# EAGLE schematic BSC_mini (EAGLE 7.7.0), part 1 of 2
DRAWING_NUMBER: V002; DRAWN: Mario Blunk; PROJECT: SYSTEM M-1; STATUS: PRODUCT

## Sheet 1 of 25
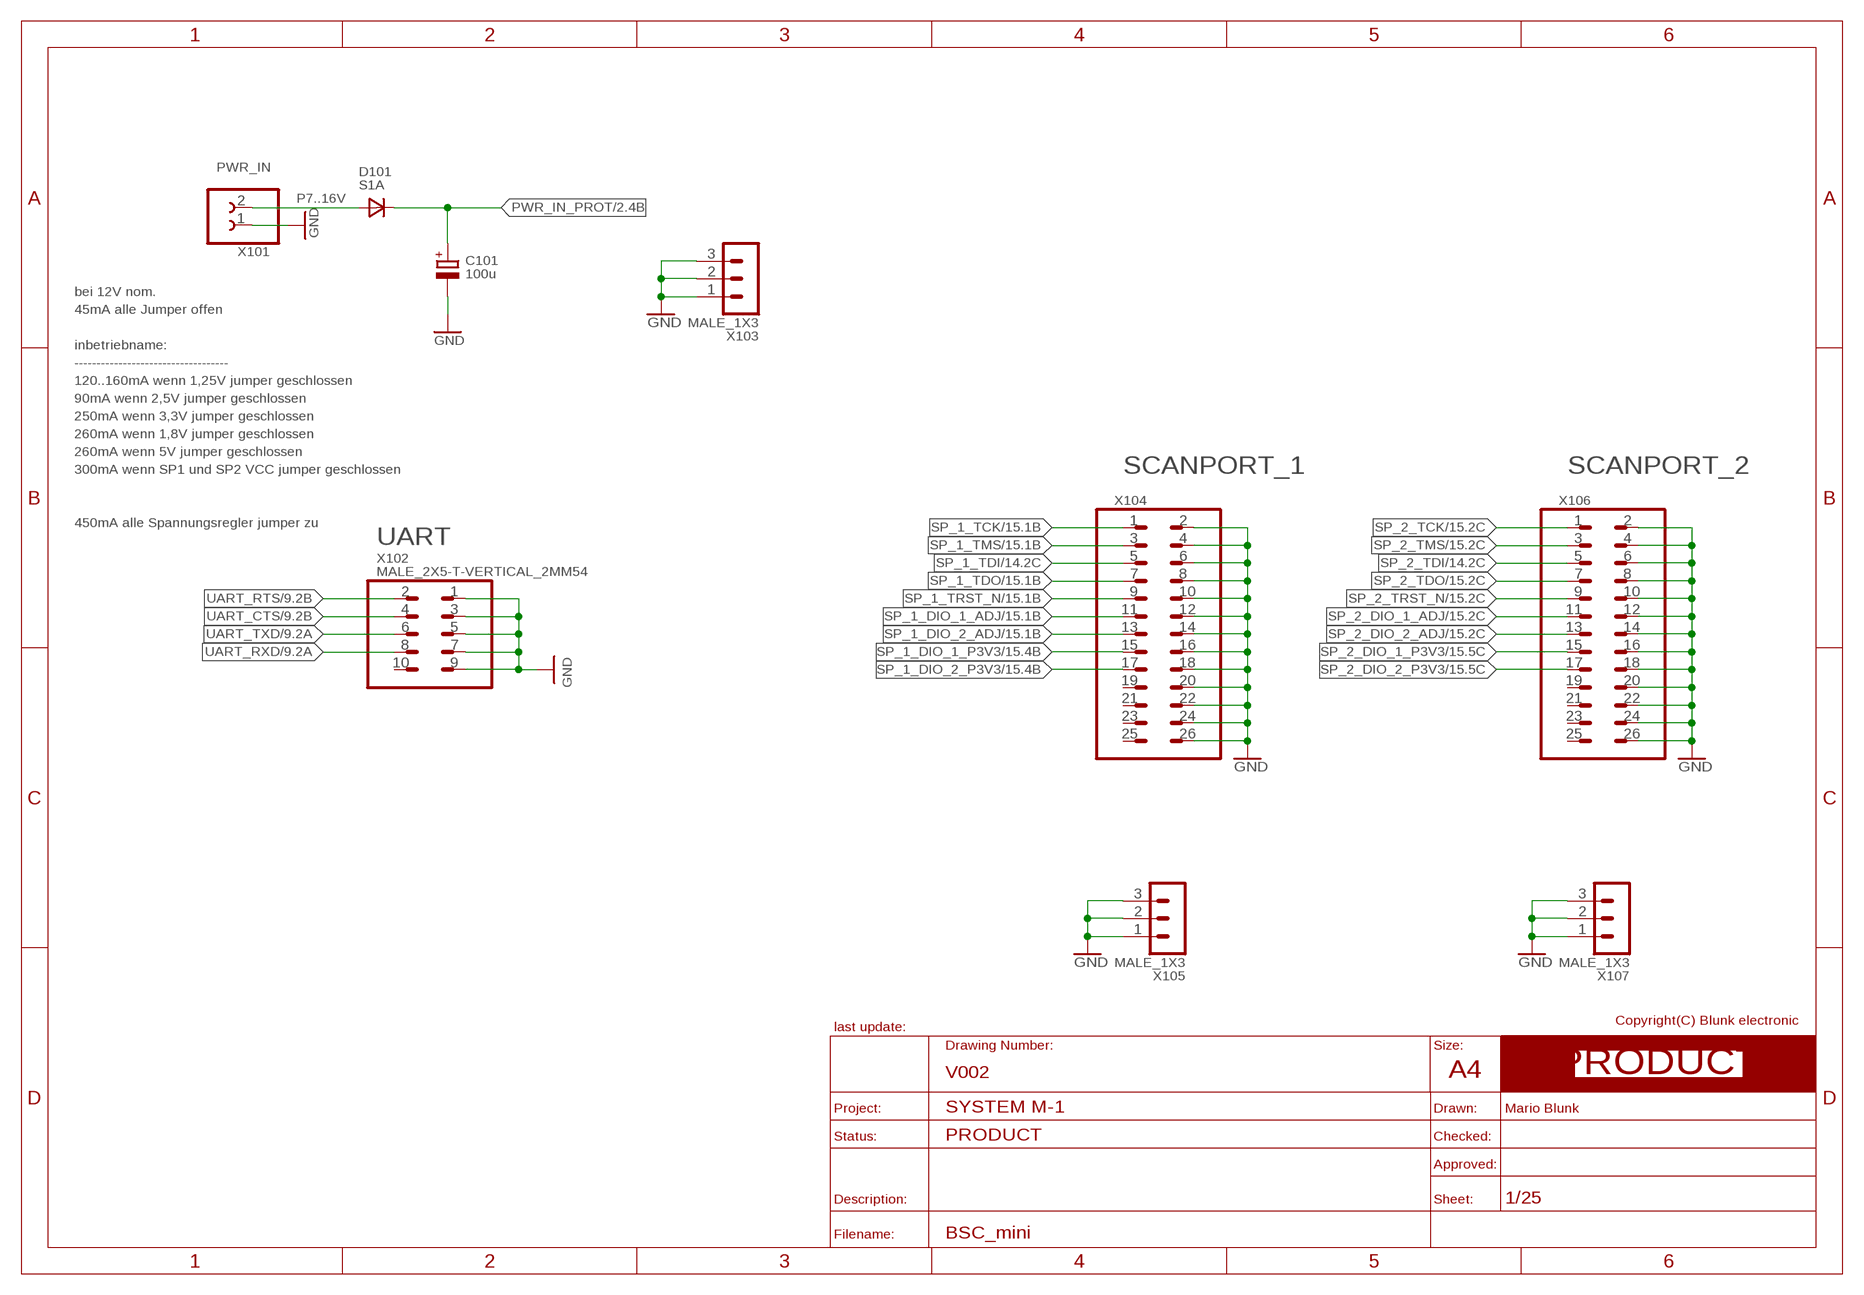
[diagram p0: schematic, sheet 1]
FRAME_PRODUCT2 (A4_LANDSCAPE_PRODUCT): BOM: NO; COMMISSIONED: 2013-08-30; DESCRIPTION: POWER-IN AND SCANPORT CNTRS

### Parts
C101  100u  C_POL_S_RAD_10MM  [S_RADIAL_10MM]
D101  S1A  SINGLE_S_DO214AC  [S_DO214AC]
X101  CLAMP_1X2-T-2.5MM  [T_WIRE_CLAMP_1X2_PITCH_2MM5]
X102  MALE_2X5-T-VERTICAL_2MM54  [T_MALE_2X5_VERTICAL_PITCH_2MM54]
X103  MALE_1X3  [T_MALE_3X1_VERTICAL]
X104  MALE_2X13-T-VERTICAL_PITCH_2MM54  [T_MALE_2X13_VERTICAL_PITCH_2MM54]
X105  MALE_1X3  [T_MALE_3X1_VERTICAL]
X106  MALE_2X13-T-VERTICAL_PITCH_2MM54  [T_MALE_2X13_VERTICAL_PITCH_2MM54]
X107  MALE_1X3  [T_MALE_3X1_VERTICAL]

### Nets
GND: C101.- X101.1 X102.1 X102.3 X102.5 X102.7 X102.9 X103.1 X103.2 X103.3 X104.2 X104.4 X104.6 X104.8 X104.10 X104.12 X104.14 X104.16 X104.18 X104.20 X104.22 X104.24 X104.26 X105.1 X105.2 X105.3 X106.2 X106.4 X106.6 X106.8 X106.10 X106.12 X106.14 X106.16 X106.18 X106.20 X106.22 X106.24 X106.26 X107.1 X107.2 X107.3 ; also sheet 2,3,4,5,6,7,8,11,12,13,14,16,17,18,19,20,21,22,23,24,25
PWR_IN: D101.A X101.2
PWR_IN_PROT: C101.+ D101.C ; also sheet 2,3
SP_1_DIO_1_ADJ: X104.11 ; also sheet 15,23
SP_1_DIO_1_P3V3: X104.15 ; also sheet 15,23
SP_1_DIO_2_ADJ: X104.13 ; also sheet 15,23
SP_1_DIO_2_P3V3: X104.17 ; also sheet 15,23
SP_1_TCK: X104.1 ; also sheet 15,21
SP_1_TDI: X104.5 ; also sheet 14
SP_1_TDO: X104.7 ; also sheet 15,21
SP_1_TMS: X104.3 ; also sheet 15,21
SP_1_TRST_N: X104.9 ; also sheet 15,22
SP_2_DIO_1_ADJ: X106.11 ; also sheet 15,23
SP_2_DIO_1_P3V3: X106.15 ; also sheet 15,23
SP_2_DIO_2_ADJ: X106.13 ; also sheet 15,23
SP_2_DIO_2_P3V3: X106.17 ; also sheet 15,23
SP_2_TCK: X106.1 ; also sheet 15,21
SP_2_TDI: X106.5 ; also sheet 14
SP_2_TDO: X106.7 ; also sheet 15,21
SP_2_TMS: X106.3 ; also sheet 15,21
SP_2_TRST_N: X106.9 ; also sheet 15,22
UART_CTS: X102.4 ; also sheet 9
UART_RTS: X102.2 ; also sheet 9
UART_RXD: X102.8 ; also sheet 9
UART_TXD: X102.6 ; also sheet 9
Unconnected: X102.10 X104.19 X104.21 X104.23 X104.25 X106.19 X106.21 X106.23 X106.25

### Notes on the sheet
- P7..16V
- bei 12V nom.
- 45mA alle Jumper offen
- inbetriebname:
- -----------------------------------
- 120..160mA wenn 1,25V jumper geschlossen
- 90mA wenn 2,5V jumper geschlossen
- 250mA wenn 3,3V jumper geschlossen
- 260mA wenn 1,8V jumper geschlossen
- 260mA wenn 5V jumper geschlossen
- 300mA wenn SP1 und SP2 VCC jumper geschlossen
- 450mA alle Spannungsregler jumper zu

## Sheet 2 of 25
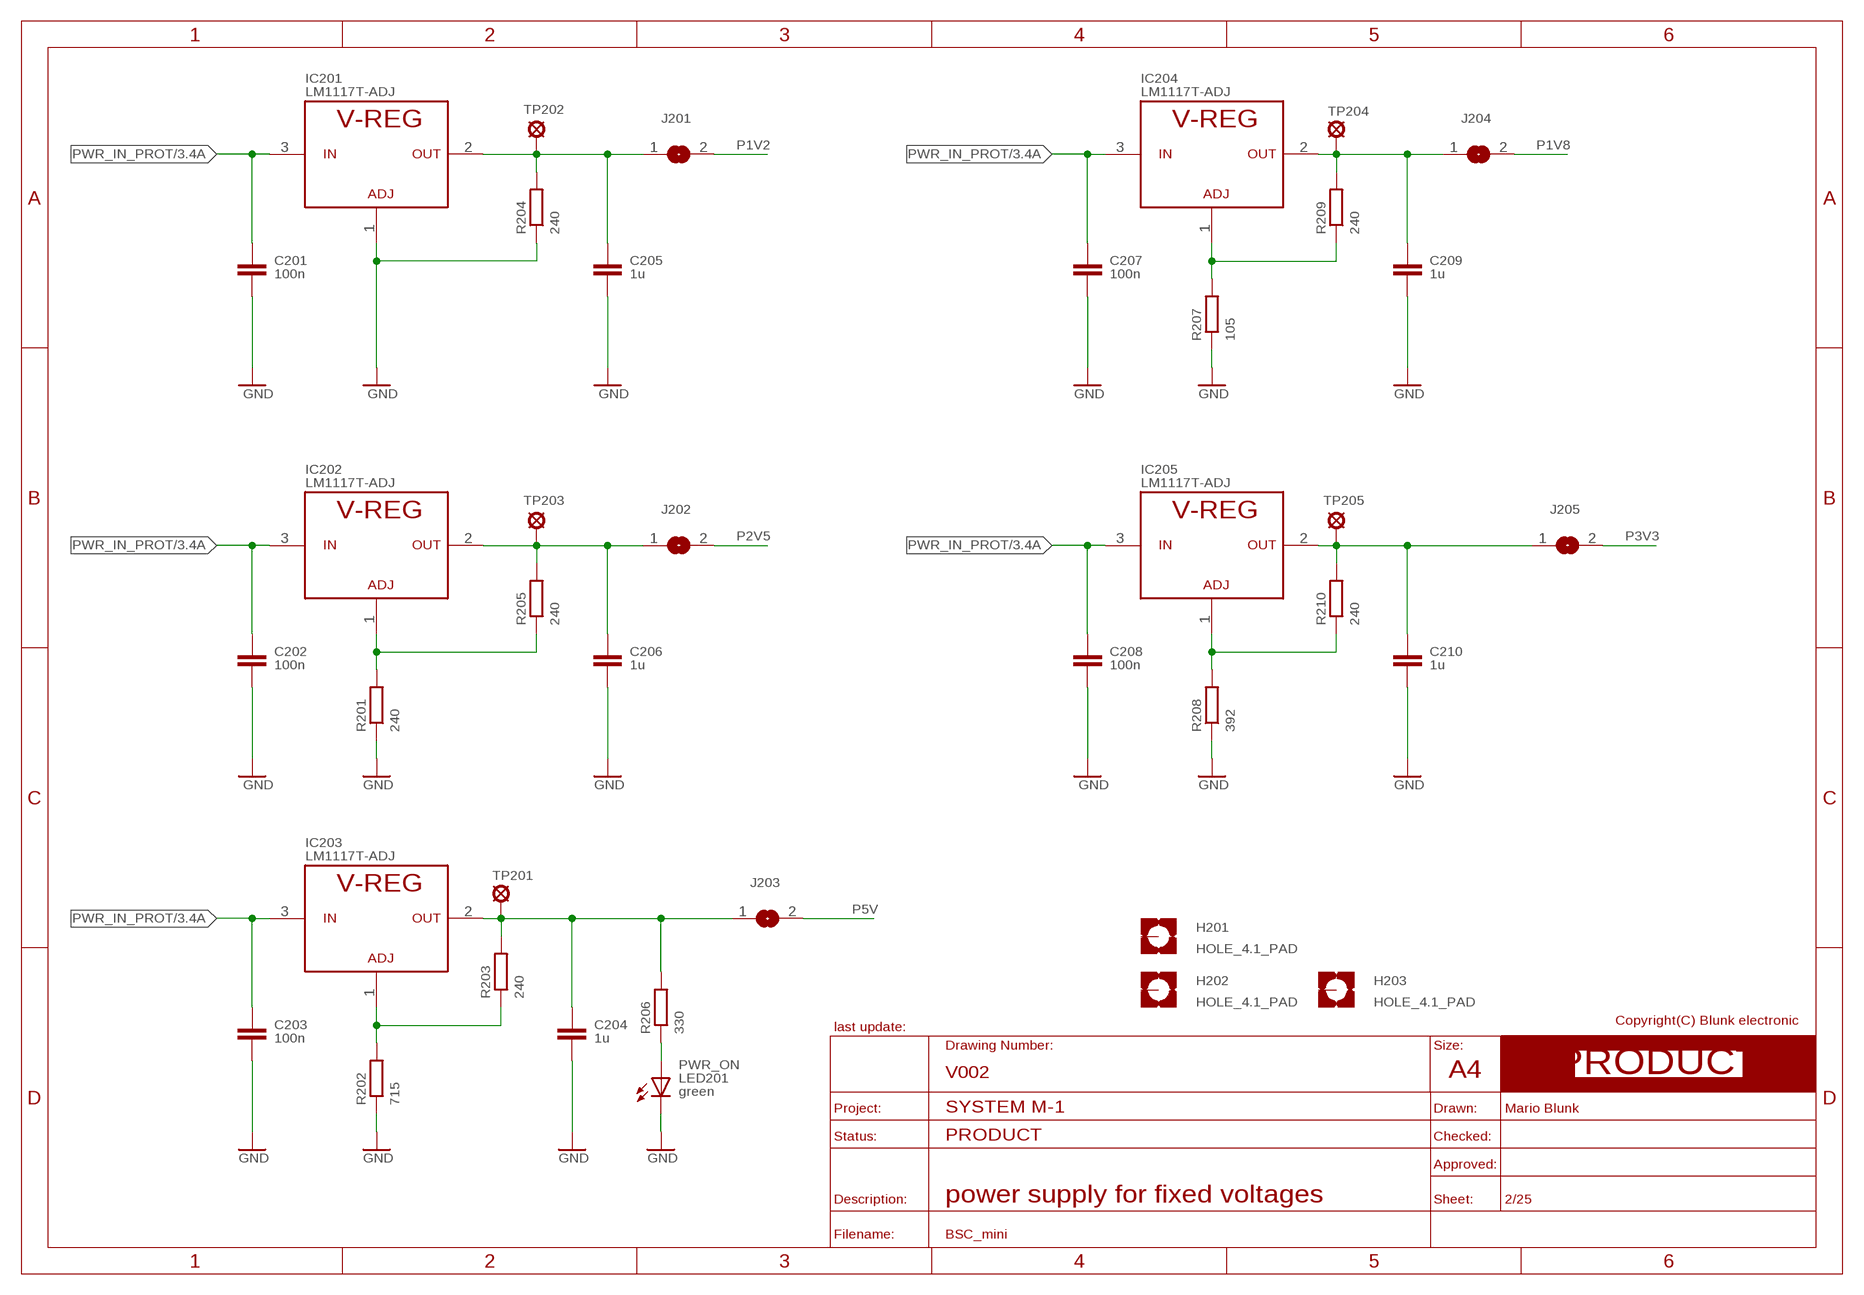
[diagram p1: schematic, sheet 2]
FRAME_PRODUCT5 (A4_LANDSCAPE_PRODUCT): BOM: NO; COMMISSIONED: 2013-08-30; DESCRIPTION: power supply for fixed voltages

### Parts
C201  100n  C_S_0805  [S_0805]
C202  100n  C_S_0805  [S_0805]
C203  100n  C_S_0805  [S_0805]
C204  1u  C_S_0805  [S_0805]
C205  1u  C_S_0805  [S_0805]
C206  1u  C_S_0805  [S_0805]
C207  100n  C_S_0805  [S_0805]
C208  100n  C_S_0805  [S_0805]
C209  1u  C_S_0805  [S_0805]
C210  1u  C_S_0805  [S_0805]
H201  HOLE_4.1_PAD  [4.1_PAD]
H202  HOLE_4.1_PAD  [4.1_PAD]
H203  HOLE_4.1_PAD  [4.1_PAD]
IC201  LM1117T-ADJ  LMXX17-T_VERTICAL  [T_TO220-3_VERTICAL]
IC202  LM1117T-ADJ  LMXX17-T_VERTICAL  [T_TO220-3_VERTICAL]
IC203  LM1117T-ADJ  LMXX17-T_VERTICAL  [T_TO220-3_VERTICAL]
IC204  LM1117T-ADJ  LMXX17-T_VERTICAL  [T_TO220-3_VERTICAL]
IC205  LM1117T-ADJ  LMXX17-T_HORIZONTAL  [T_TO220-3_HORIZONTAL]
J201  SOLDER_JUMPER-N  [S_SOLDER_JUMPER_NARROW]
J202  SOLDER_JUMPER-N  [S_SOLDER_JUMPER_NARROW]
J203  SOLDER_JUMPER-N  [S_SOLDER_JUMPER_NARROW]
J204  SOLDER_JUMPER-N  [S_SOLDER_JUMPER_NARROW]
J205  SOLDER_JUMPER-N  [S_SOLDER_JUMPER_NARROW]
LED201  green  LED_S_0805  [S_0805]
R201  240  R_S_0805  [S_0805]
R202  715  R_S_0805  [S_0805]
R203  240  R_S_0805  [S_0805]
R204  240  R_S_0805  [S_0805]
R205  240  R_S_0805  [S_0805]
R206  330  R_S_0805  [S_0805]
R207  105  R_S_0805  [S_0805]
R208  392  R_S_0805  [S_0805]
R209  240  R_S_0805  [S_0805]
R210  240  R_S_0805  [S_0805]
TP201  TEST_POINT_T_SMALL  [T_TEST_POINT_SMALL]
TP202  +1V2  TEST_POINT_T_SMALL  [T_TEST_POINT_SMALL]
TP203  +2V5  TEST_POINT_T_SMALL  [T_TEST_POINT_SMALL]
TP204  TEST_POINT_T_SMALL  [T_TEST_POINT_SMALL]
TP205  +2V5  TEST_POINT_T_SMALL  [T_TEST_POINT_SMALL]

### Nets
GND: C201.2 C202.2 C203.2 C204.2 C205.2 C206.2 C207.2 C208.2 C209.2 C210.2 IC201.1(AJD) LED201.C R201.1 R202.1 R204.1 R207.1 R208.1 ; also sheet 1,3,4,5,6,7,8,11,12,13,14,16,17,18,19,20,21,22,23,24,25
P1V2: J201.2 ; also sheet 11
P1V8: J204.2 ; also sheet 16
P2V5: J202.2 ; also sheet 5,8,10,11
P3V3: J205.2 ; also sheet 3,4,6,7,8,9,10,11,12,13,14,16,17,18,19,20,21,22,23,24,25
P5V: J203.2 ; also sheet 13
PWR_ADJ_P1V8: IC204.1(AJD) R207.2 R209.1
PWR_ADJ_P2V5: IC202.1(AJD) R201.2 R205.1
PWR_ADJ_P3V3: IC205.1(AJD) R208.2 R210.1
PWR_ADJ_P5V: IC203.1(AJD) R202.2 R203.1
PWR_IN_PROT: C201.1 C202.1 C203.1 C207.1 C208.1 IC201.3(IN) IC202.3(IN) IC203.3(IN) IC204.3(IN) IC205.3(IN) ; also sheet 1,3
PWR_LED_P5V: LED201.A R206.1
PWR_P1V2: C205.1 IC201.2(OUT) J201.1 R204.2 TP202.1(TP)
PWR_P1V8: C209.1 IC204.2(OUT) J204.1 R209.2 TP204.1(TP)
PWR_P2V5: C206.1 IC202.2(OUT) J202.1 R205.2 TP203.1(TP)
PWR_P3V3: C210.1 IC205.2(OUT) J205.1 R210.2 TP205.1(TP)
PWR_P5V: C204.1 IC203.2(OUT) J203.1 R203.2 R206.2 TP201.1(TP)
Unconnected: H201.H1(MOUNT) H202.H1(MOUNT) H203.H1(MOUNT)

## Sheet 3 of 25
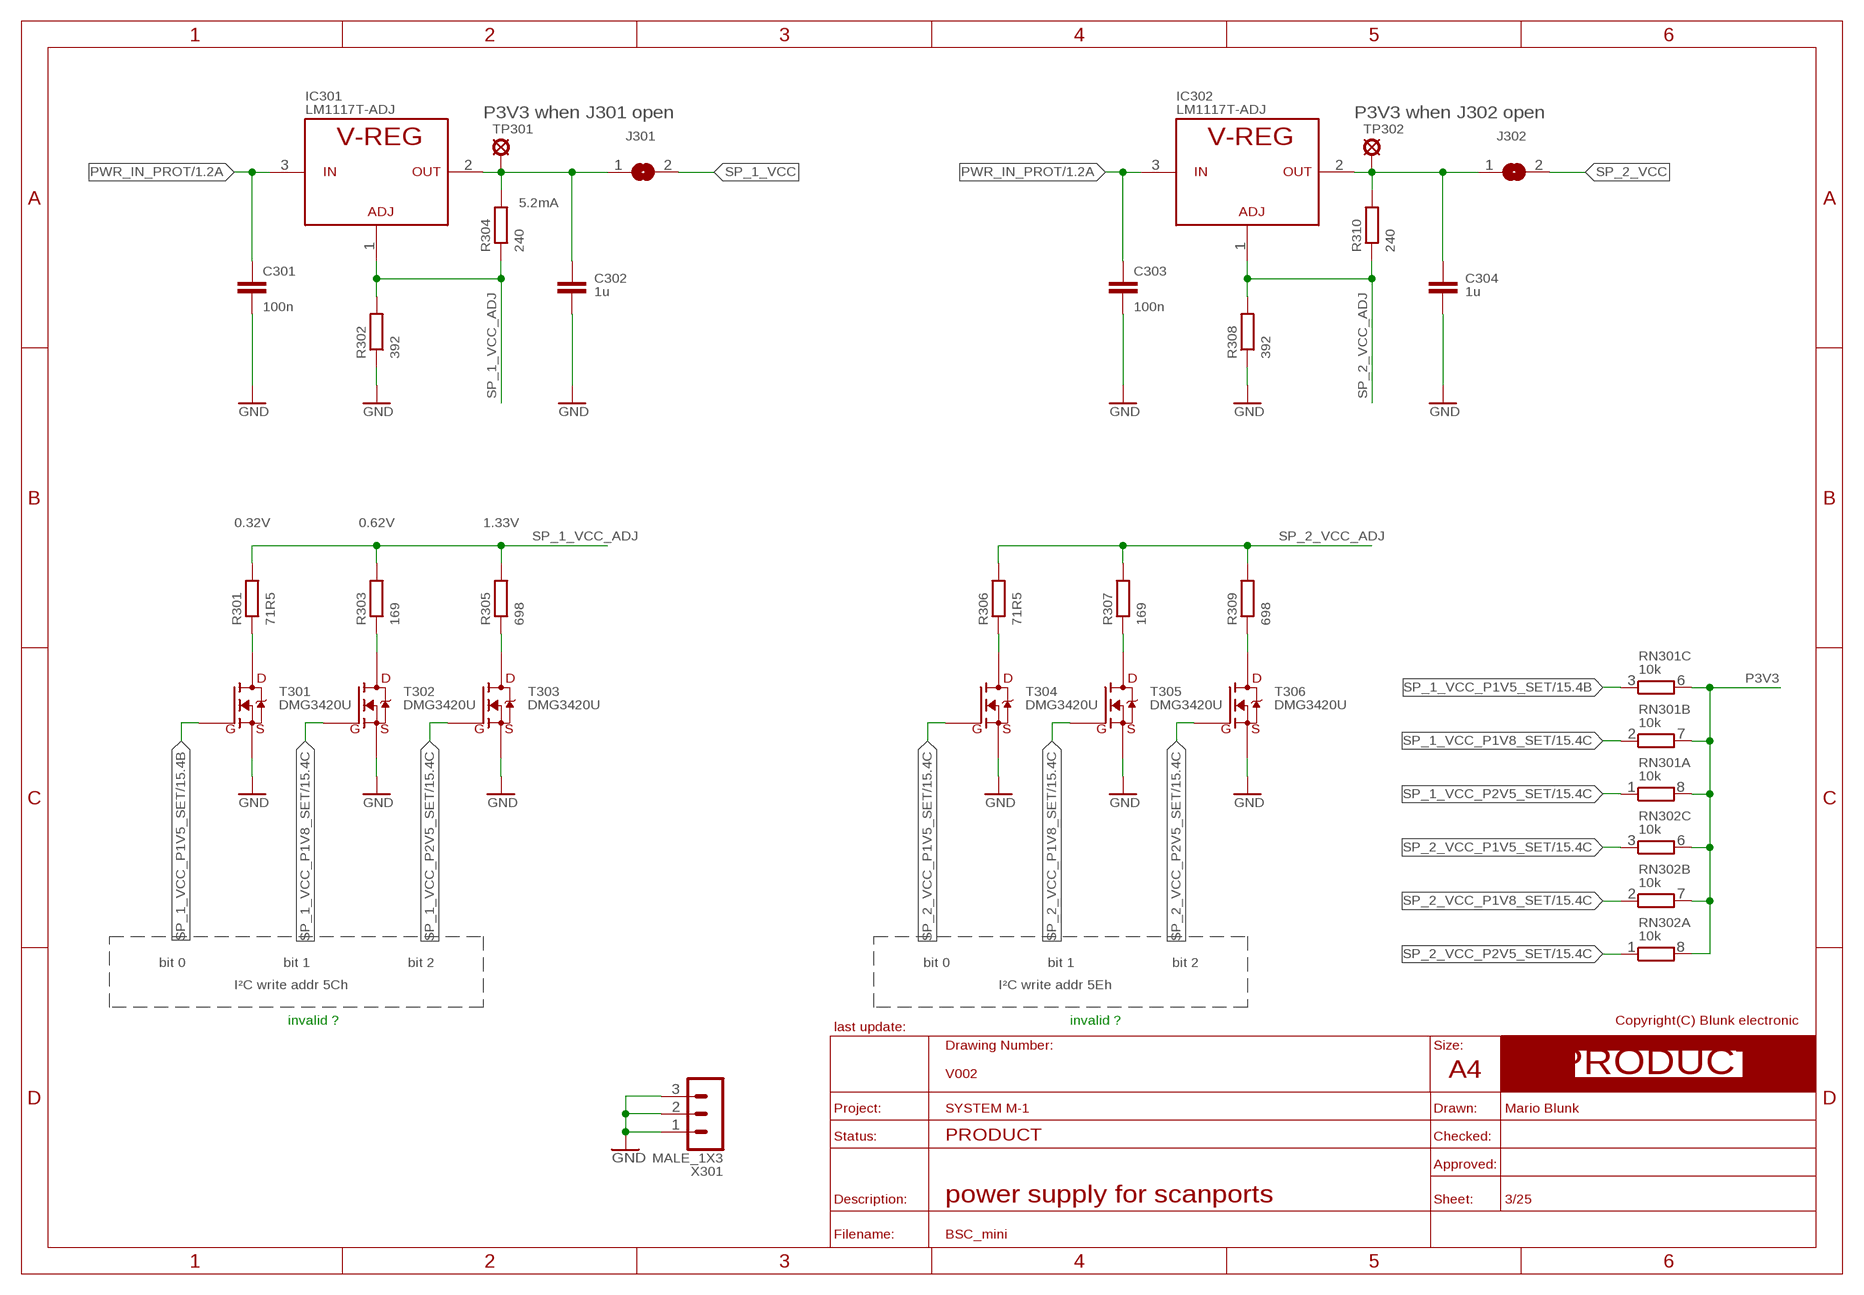
[diagram p2: schematic, sheet 3]
FRAME_PRODUCT23 (A4_LANDSCAPE_PRODUCT): BOM: NO; COMMISSIONED: 2013-08-30; DESCRIPTION: power supply for scanports

### Parts
C301  100n  C_S_0805  [S_0805]
C302  1u  C_S_0805  [S_0805]
C303  100n  C_S_0805  [S_0805]
C304  1u  C_S_0805  [S_0805]
IC301  LM1117T-ADJ  LMXX17-T_VERTICAL  [T_TO220-3_VERTICAL]
IC302  LM1117T-ADJ  LMXX17-T_VERTICAL  [T_TO220-3_VERTICAL]
J301  SOLDER_JUMPER-N  [S_SOLDER_JUMPER_NARROW]
J302  SOLDER_JUMPER-N  [S_SOLDER_JUMPER_NARROW]
R301  71R5  R_S_0805  [S_0805]
R302  392  R_S_0805  [S_0805]
R303  169  R_S_0805  [S_0805]
R304  240  R_S_0805  [S_0805]
R305  698  R_S_0805  [S_0805]
R306  71R5  R_S_0805  [S_0805]
R307  169  R_S_0805  [S_0805]
R308  392  R_S_0805  [S_0805]
R309  698  R_S_0805  [S_0805]
R310  240  R_S_0805  [S_0805]
RN301  10k  RN_4S_1206  [S_1206_4X]
RN302  10k  RN_4S_1206  [S_1206_4X]
T301  DMG3420U  N-MOSFET_S_SOT23  [S_SOT23]
T302  DMG3420U  N-MOSFET_S_SOT23  [S_SOT23]
T303  DMG3420U  N-MOSFET_S_SOT23  [S_SOT23]
T304  DMG3420U  N-MOSFET_S_SOT23  [S_SOT23]
T305  DMG3420U  N-MOSFET_S_SOT23  [S_SOT23]
T306  DMG3420U  N-MOSFET_S_SOT23  [S_SOT23]
TP301  TEST_POINT_T_SMALL  [T_TEST_POINT_SMALL]
TP302  TEST_POINT_T_SMALL  [T_TEST_POINT_SMALL]
X301  MALE_1X3  [T_MALE_3X1_VERTICAL]

### Nets
GND: C301.2 C302.2 C303.2 C304.2 R302.1 R308.1 T301.2(S) T302.2(S) T303.2(S) T304.2(S) T305.2(S) T306.2(S) X301.1 X301.2 X301.3 ; also sheet 1,2,4,5,6,7,8,11,12,13,14,16,17,18,19,20,21,22,23,24,25
P3V3: RN301.6 RN301.7 RN301.8 RN302.6 RN302.7 RN302.8 ; also sheet 2,4,6,7,8,9,10,11,12,13,14,16,17,18,19,20,21,22,23,24,25
PWR_IN_PROT: C301.1 C303.1 IC301.3(IN) IC302.3(IN) ; also sheet 1,2
SP_1_VCC: J301.2 ; also sheet 16
SP_1_VCC_ADJ: IC301.1(AJD) R301.2 R302.2 R303.2 R304.1 R305.2
SP_1_VCC_P1V5_D: R301.1 T301.3(D)
SP_1_VCC_P1V5_SET: RN301.3 T301.1(G) ; also sheet 15,24
SP_1_VCC_P1V8_D: R303.1 T302.3(D)
SP_1_VCC_P1V8_SET: RN301.2 T302.1(G) ; also sheet 15,24
SP_1_VCC_P2V5_D: R305.1 T303.3(D)
SP_1_VCC_P2V5_SET: RN301.1 T303.1(G) ; also sheet 15,24
SP_1_VCC_REG: C302.1 IC301.2(OUT) J301.1 R304.2 TP301.1(TP)
SP_2_VCC: J302.2 ; also sheet 16
SP_2_VCC_ADJ: IC302.1(AJD) R306.2 R307.2 R308.2 R309.2 R310.1
SP_2_VCC_P1V5_D: R306.1 T304.3(D)
SP_2_VCC_P1V5_SET: RN302.3 T304.1(G) ; also sheet 15,25
SP_2_VCC_P1V8_D: R307.1 T305.3(D)
SP_2_VCC_P1V8_SET: RN302.2 T305.1(G) ; also sheet 15,25
SP_2_VCC_P2V5_D: R309.1 T306.3(D)
SP_2_VCC_P2V5_SET: RN302.1 T306.1(G) ; also sheet 15,25
SP_2_VCC_REG: C304.1 IC302.2(OUT) J302.1 R310.2 TP302.1(TP)
Unconnected: RN301.4 RN301.5 RN302.4 RN302.5

### Notes on the sheet
- P3V3 when J301 open | P3V3 when J302 open
- 5.2mA
- 0.32V | 0.62V | 1.33V
- bit 0 | bit 1 | bit 2 | bit 0 | bit 1 | bit 2
- I²C write addr 5Ch | I²C write addr 5Eh
- invalid ? | invalid ?

## Sheet 4 of 25
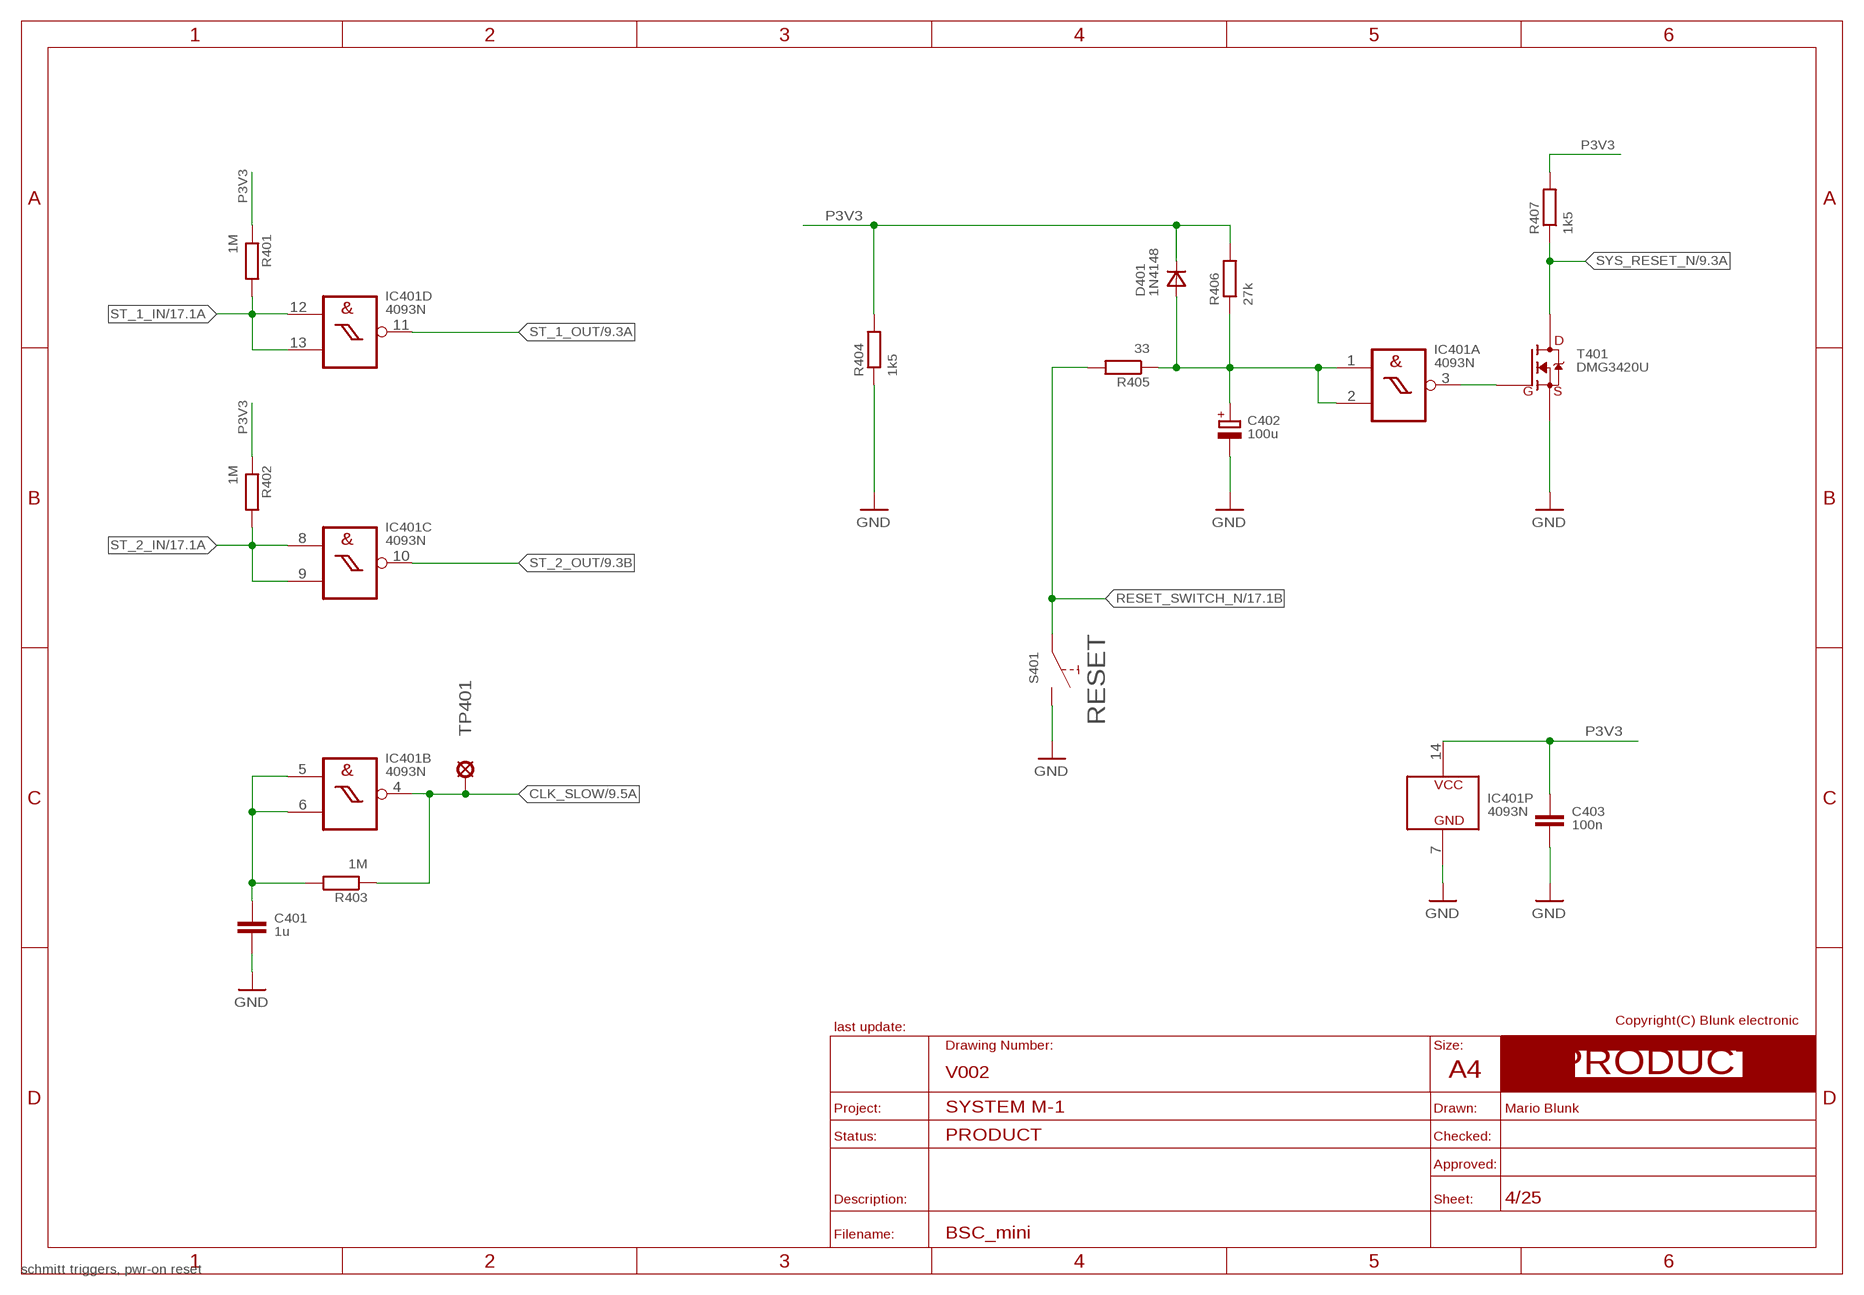
[diagram p3: schematic, sheet 4]
FRAME_PRODUCT4 (A4_LANDSCAPE_PRODUCT): BOM: NO; COMMISSIONED: 2013-08-30; DESCRIPTION: schmitt triggers, pwr-on reset

### Parts
C401  1u  C_S_0805  [S_0805]
C402  100u  C_POL_S_6032  [S_6032]
C403  100n  C_S_0805  [S_0805]
D401  1N4148  SINGLES_SOD123  [S_SOD123]
IC401  4093N  [T_NDIP14]
R401  1M  R_S_0805  [S_0805]
R402  1M  R_S_0805  [S_0805]
R403  1M  R_S_0805  [S_0805]
R404  1k5  R_S_0805  [S_0805]
R405  33  R_S_0805  [S_0805]
R406  27k  R_S_0805  [S_0805]
R407  1k5  R_S_0805  [S_0805]
S401  PUSH_BUTTON_T_6X6MM  [T_PUSH_BUTTON_6X6]
T401  DMG3420U  N-MOSFET_S_SOT23  [S_SOT23]
TP401  clk_slow  TEST_POINT_T_SMALL  [T_TEST_POINT_SMALL]

### Nets
CLK_SLOW: IC401.4(B:O) R403.1 TP401.1(TP) ; also sheet 9,17
GND: C401.2 C402.- C403.2 IC401.7(P:GND) R404.1 S401.2(B1) S401.4(B1) T401.2(S) ; also sheet 1,2,3,5,6,7,8,11,12,13,14,16,17,18,19,20,21,22,23,24,25
OSC_RC: C401.1 IC401.5(B:I0) IC401.6(B:I1) R403.2
P3V3: C403.1 D401.C IC401.14(P:VCC) R401.1 R402.1 R404.2 R406.2 R407.2 ; also sheet 2,3,6,7,8,9,10,11,12,13,14,16,17,18,19,20,21,22,23,24,25
RESET_RC_N: C402.+ D401.A IC401.1(A:I0) IC401.2(A:I1) R405.1 R406.1
RESET_SWITCH_N: R405.2 S401.1(A1) S401.3(A1) ; also sheet 17
ST_1_IN: IC401.12(D:I0) IC401.13(D:I1) R401.2 ; also sheet 17
ST_1_OUT: IC401.11(D:O) ; also sheet 9,17
ST_2_IN: IC401.8(C:I0) IC401.9(C:I1) R402.2 ; also sheet 17
ST_2_OUT: IC401.10(C:O) ; also sheet 9,17
SYS_RESET: IC401.3(A:O) T401.1(G)
SYS_RESET_N: R407.1 T401.3(D) ; also sheet 9,15,17

## Sheet 5 of 25
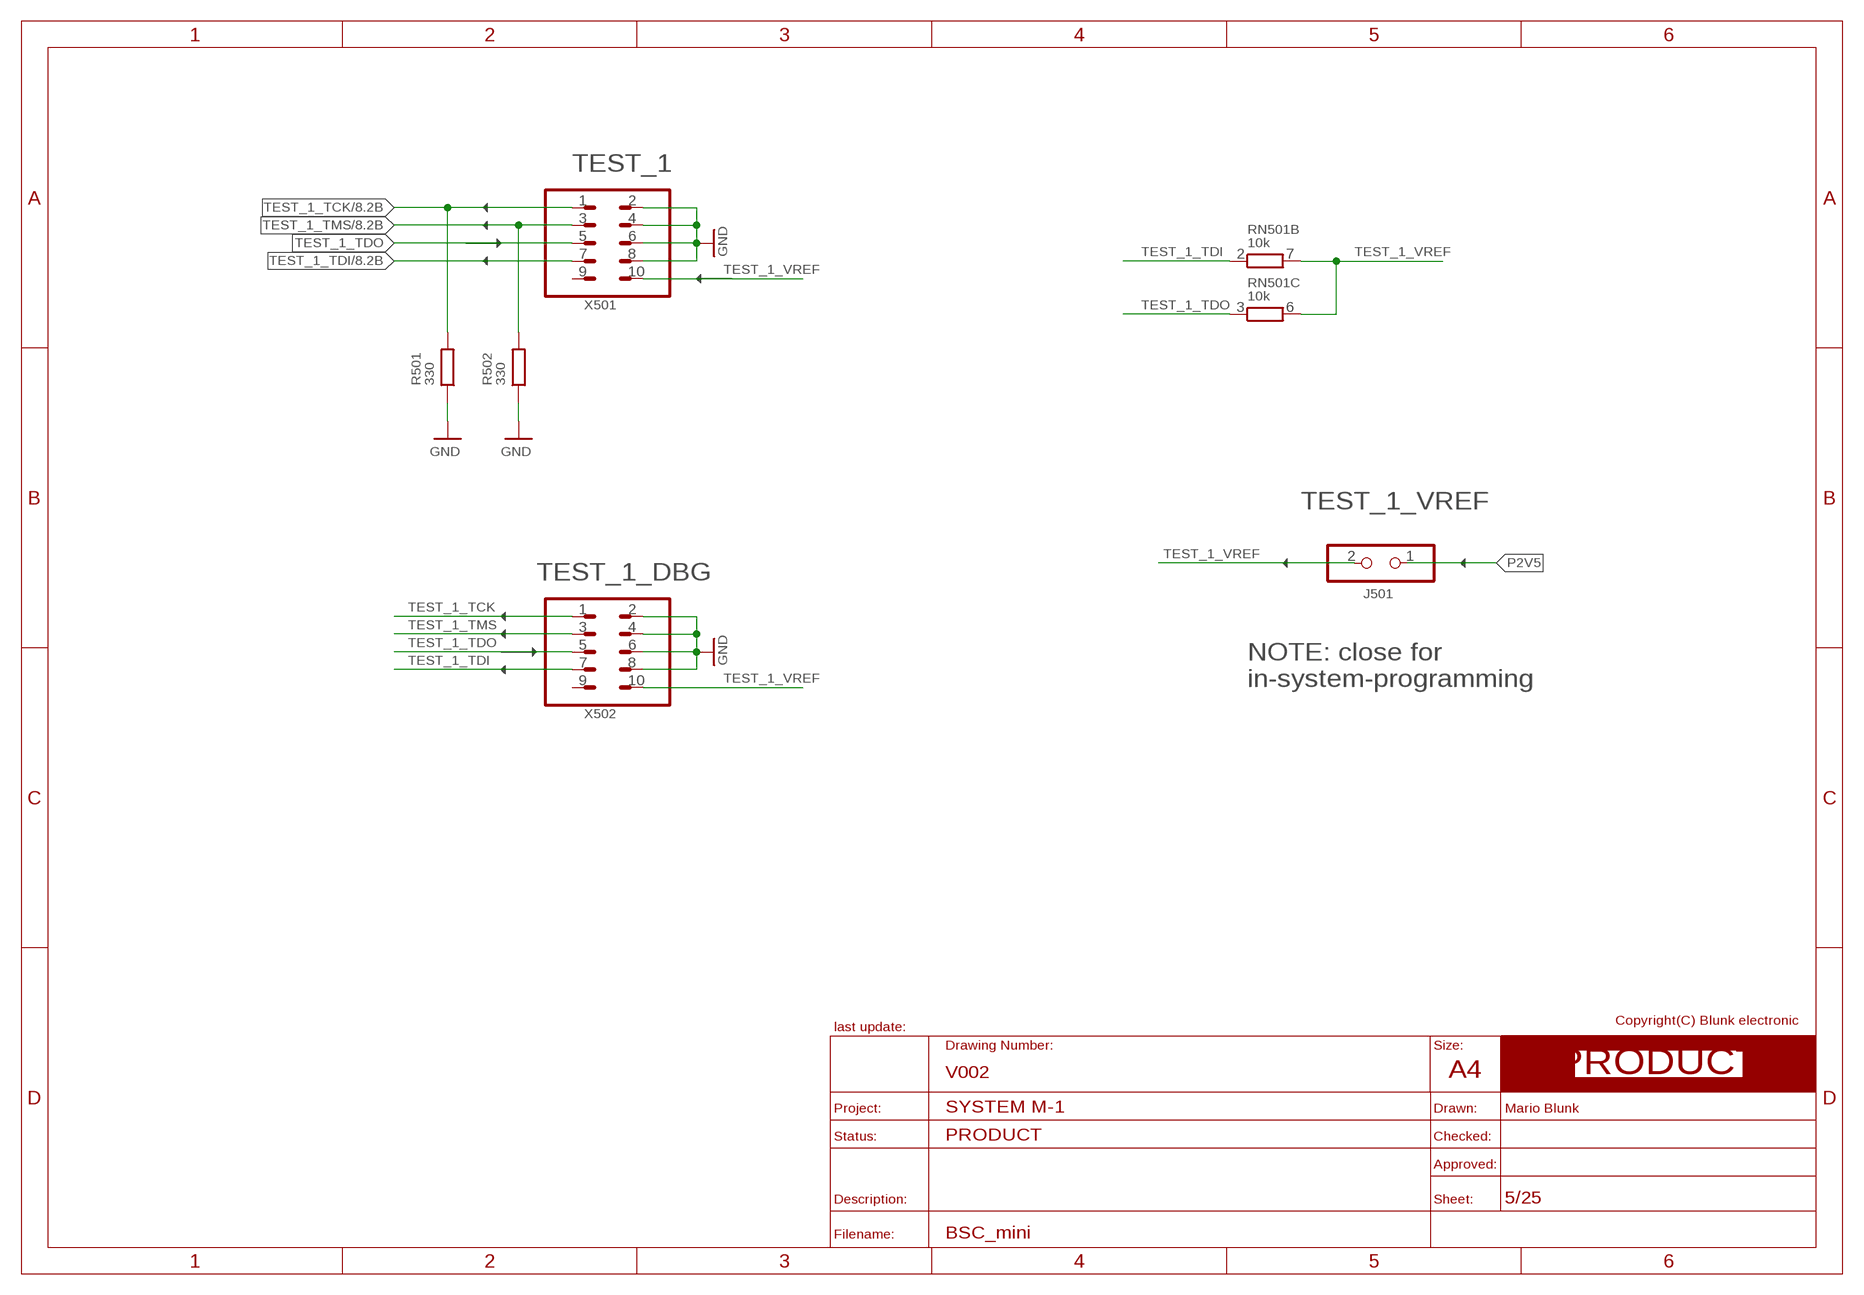
[diagram p4: schematic, sheet 5]
FRAME_PRODUCT1 (A4_LANDSCAPE_PRODUCT): BOM: NO; COMMISSIONED: 2013-08-30; DESCRIPTION: IEEE1149.1 FPGA
U$16 (ARROW_1): BOM: NO; COMMISSIONED: 2013-08-30
U$17 (ARROW_1): BOM: NO; COMMISSIONED: 2013-08-30
U$18 (ARROW_1): BOM: NO; COMMISSIONED: 2013-08-30
U$19 (ARROW_1): BOM: NO; COMMISSIONED: 2013-08-30
U$20 (ARROW_1): BOM: NO; COMMISSIONED: 2013-08-30
U$21 (ARROW_1): BOM: NO; COMMISSIONED: 2013-08-30
U$22 (ARROW_1): BOM: NO; COMMISSIONED: 2013-08-30
U$23 (ARROW_1): BOM: NO; COMMISSIONED: 2013-08-30
U$24 (ARROW_1): BOM: NO; COMMISSIONED: 2013-08-30
U$41 (ARROW_1): BOM: NO; COMMISSIONED: 2013-08-30
U$42 (ARROW_1): BOM: NO; COMMISSIONED: 2013-08-30

### Parts
J501  JUMPER_1X2-T-VERTICAL_GRID_2.54MM  [T_MALE_2X1_VERTICAL_PITCH_2MM54]
R501  330  R_S_0805  [S_0805]
R502  330  R_S_0805  [S_0805]
RN501  10k  RN_4S_1206  [S_1206_4X]
X501  MALE_2X5-T-VERTICAL_2MM54  [T_MALE_2X5_VERTICAL_PITCH_2MM54]
X502  MALE_2X5-T-VERTICAL_2MM54  [T_MALE_2X5_VERTICAL_PITCH_2MM54]

### Nets
GND: R501.1 R502.1 X501.2 X501.4 X501.6 X501.8 X502.2 X502.4 X502.6 X502.8 ; also sheet 1,2,3,4,6,7,8,11,12,13,14,16,17,18,19,20,21,22,23,24,25
P2V5: J501.1 ; also sheet 2,8,10,11
TEST_1_TCK: R501.2 X501.1 X502.1 ; also sheet 8
TEST_1_TDI: RN501.2 X501.7 X502.7 ; also sheet 8
TEST_1_TDO: RN501.3 X501.5 X502.5 ; also sheet 8
TEST_1_TMS: R502.2 X501.3 X502.3 ; also sheet 8
TEST_1_VREF: J501.2 RN501.6 RN501.7 X501.10 X502.10
Unconnected: RN501.1 RN501.4 RN501.5 RN501.8 X501.9 X502.9

### Notes on the sheet
- NOTE: close for 
  in-system-programming

## Sheet 6 of 25
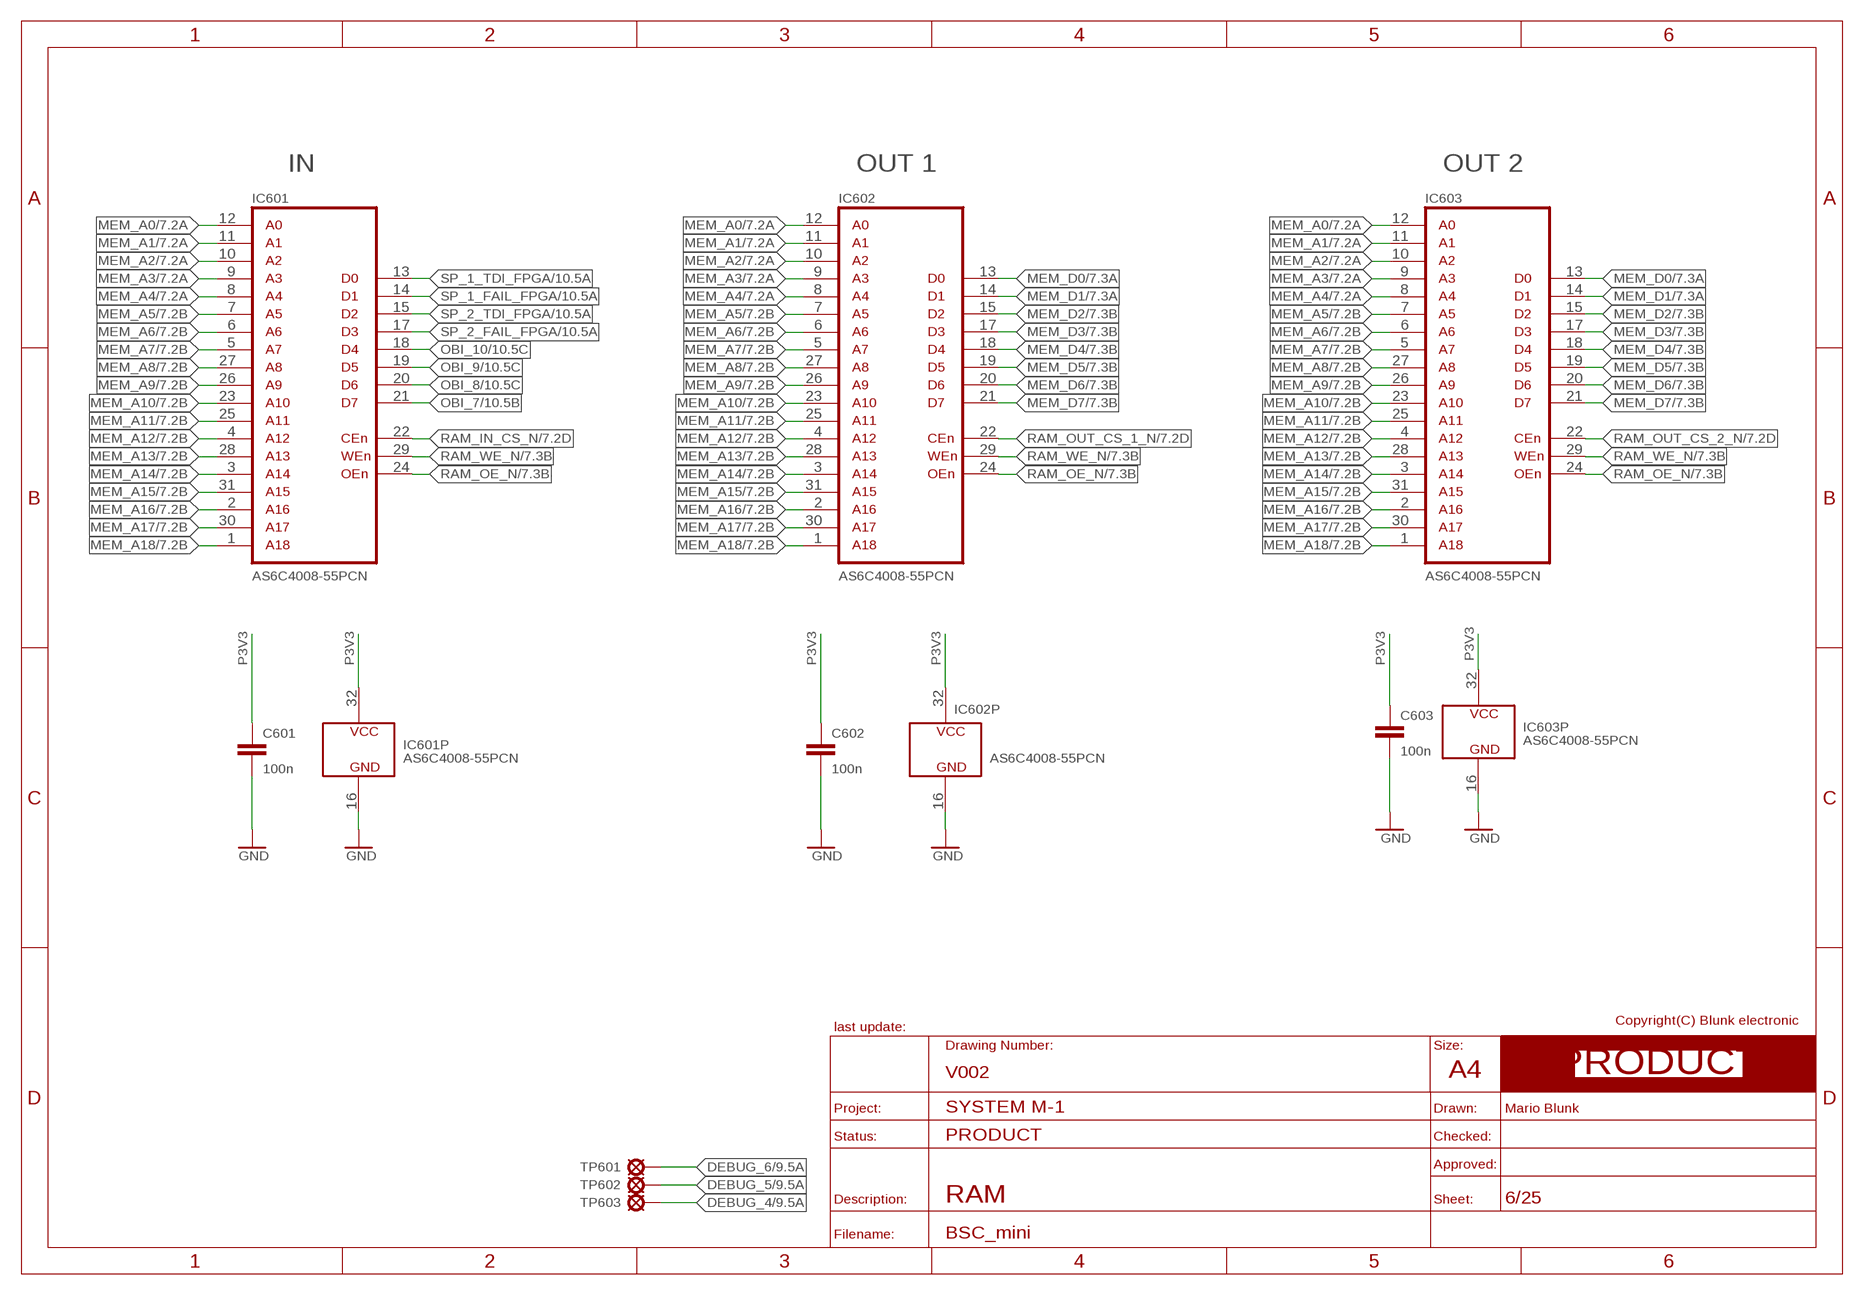
[diagram p5: schematic, sheet 6]
FRAME_PRODUCT6 (A4_LANDSCAPE_PRODUCT): BOM: NO; COMMISSIONED: 2013-08-30; DESCRIPTION: RAM

### Parts
C601  100n  C_S_0805  [S_0805]
C602  100n  C_S_0805  [S_0805]
C603  100n  C_S_0805  [S_0805]
IC601  AS6C4008-55PCN  512K_X_8_T_NDIP32  [T_NDIP32]
IC602  AS6C4008-55PCN  512K_X_8_T_NDIP32  [T_NDIP32]
IC603  AS6C4008-55PCN  512K_X_8_T_NDIP32  [T_NDIP32]
TP601  TEST_POINT_T_SMALL  [T_TEST_POINT_SMALL]
TP602  TEST_POINT_T_SMALL  [T_TEST_POINT_SMALL]
TP603  TEST_POINT_T_SMALL  [T_TEST_POINT_SMALL]

### Nets
DEBUG_4: TP603.1(TP) ; also sheet 9
DEBUG_5: TP602.1(TP) ; also sheet 9
DEBUG_6: TP601.1(TP) ; also sheet 9
GND: C601.2 C602.2 C603.2 IC601.16(GND) IC602.16(GND) IC603.16(GND) ; also sheet 1,2,3,4,5,7,8,11,12,13,14,16,17,18,19,20,21,22,23,24,25
MEM_A0: IC601.12(A0) IC602.12(A0) IC603.12(A0) ; also sheet 7,9
MEM_A1: IC601.11(A1) IC602.11(A1) IC603.11(A1) ; also sheet 7,9
MEM_A2: IC601.10(A2) IC602.10(A2) IC603.10(A2) ; also sheet 7,9
MEM_A3: IC601.9(A3) IC602.9(A3) IC603.9(A3) ; also sheet 7,9
MEM_A4: IC601.8(A4) IC602.8(A4) IC603.8(A4) ; also sheet 7,9
MEM_A5: IC601.7(A5) IC602.7(A5) IC603.7(A5) ; also sheet 7,9
MEM_A6: IC601.6(A6) IC602.6(A6) IC603.6(A6) ; also sheet 7,9
MEM_A7: IC601.5(A7) IC602.5(A7) IC603.5(A7) ; also sheet 7,9
MEM_A8: IC601.27(A8) IC602.27(A8) IC603.27(A8) ; also sheet 7,9
MEM_A9: IC601.26(A9) IC602.26(A9) IC603.26(A9) ; also sheet 7,9
MEM_A10: IC601.23(A10) IC602.23(A10) IC603.23(A10) ; also sheet 7,9
MEM_A11: IC601.25(A11) IC602.25(A11) IC603.25(A11) ; also sheet 7,9
MEM_A12: IC601.4(A12) IC602.4(A12) IC603.4(A12) ; also sheet 7,9
MEM_A13: IC601.28(A13) IC602.28(A13) IC603.28(A13) ; also sheet 7,9
MEM_A14: IC601.3(A14) IC602.3(A14) IC603.3(A14) ; also sheet 7,9
MEM_A15: IC601.31(A15) IC602.31(A15) IC603.31(A15) ; also sheet 7,9
MEM_A16: IC601.2(A16) IC602.2(A16) IC603.2(A16) ; also sheet 7,9
MEM_A17: IC601.30(A17) IC602.30(A17) IC603.30(A17) ; also sheet 7,9
MEM_A18: IC601.1(A18) IC602.1(A18) IC603.1(A18) ; also sheet 7,9
MEM_D0: IC602.13(D0) IC603.13(D0) ; also sheet 7,9
MEM_D1: IC602.14(D1) IC603.14(D1) ; also sheet 7,9
MEM_D2: IC602.15(D2) IC603.15(D2) ; also sheet 7,9
MEM_D3: IC602.17(D3) IC603.17(D3) ; also sheet 7,9
MEM_D4: IC602.18(D4) IC603.18(D4) ; also sheet 7,9
MEM_D5: IC602.19(D5) IC603.19(D5) ; also sheet 7,9
MEM_D6: IC602.20(D6) IC603.20(D6) ; also sheet 7,9
MEM_D7: IC602.21(D7) IC603.21(D7) ; also sheet 7,9
OBI_7: IC601.21(D7) ; also sheet 10,15
OBI_8: IC601.20(D6) ; also sheet 10,15
OBI_9: IC601.19(D5) ; also sheet 10,15
OBI_10: IC601.18(D4) ; also sheet 10,15
P3V3: C601.1 C602.1 C603.1 IC601.32(VCC) IC602.32(VCC) IC603.32(VCC) ; also sheet 2,3,4,7,8,9,10,11,12,13,14,16,17,18,19,20,21,22,23,24,25
RAM_IN_CS_N: IC601.22(CE) ; also sheet 7,9
RAM_OE_N: IC601.24(OE) IC602.24(OE) IC603.24(OE) ; also sheet 7,9
RAM_OUT_CS_1_N: IC602.22(CE) ; also sheet 7,9
RAM_OUT_CS_2_N: IC603.22(CE) ; also sheet 7,9
RAM_WE_N: IC601.29(WE) IC602.29(WE) IC603.29(WE) ; also sheet 7,9,17
SP_1_FAIL_FPGA: IC601.14(D1) ; also sheet 10,21
SP_1_TDI_FPGA: IC601.13(D0) ; also sheet 10,15
SP_2_FAIL_FPGA: IC601.17(D3) ; also sheet 10,21
SP_2_TDI_FPGA: IC601.15(D2) ; also sheet 10,15

### Notes on the sheet
- IN | OUT 1 | OUT 2

## Sheet 7 of 25
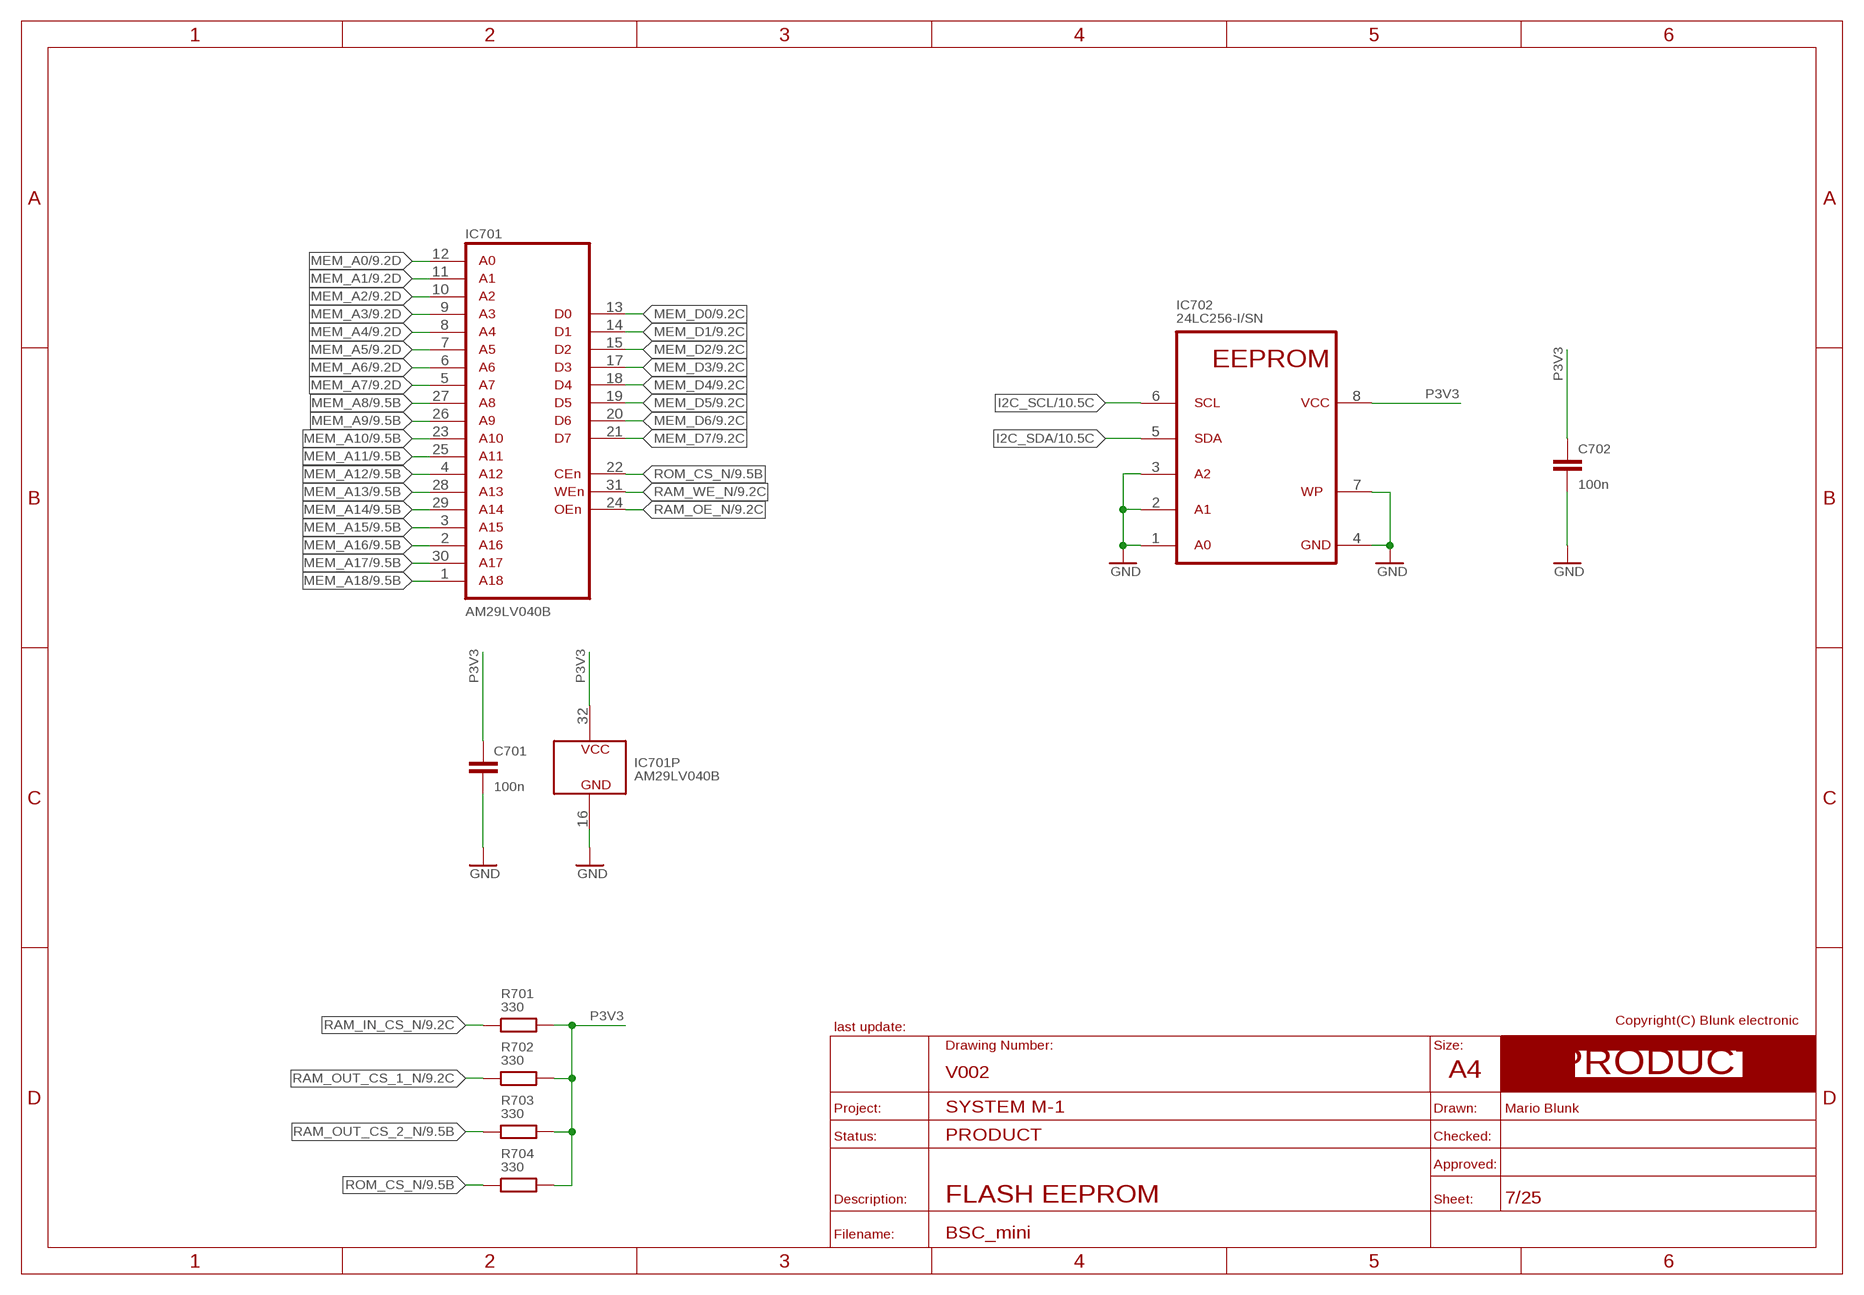
[diagram p6: schematic, sheet 7]
FRAME_PRODUCT3 (A4_LANDSCAPE_PRODUCT): BOM: NO; COMMISSIONED: 2013-08-30; DESCRIPTION: FLASH EEPROM

### Parts
C701  100n  C_S_0805  [S_0805]
C702  100n  C_S_0805  [S_0805]
IC701  AM29LV040B  512K_X_8T_PLCC32  [T_PLCC32]
IC702  24LC256-I/SN  24XXXSN  [S_SOIC8]
R701  330  R_S_0805  [S_0805]
R702  330  R_S_0805  [S_0805]
R703  330  R_S_0805  [S_0805]
R704  330  R_S_0805  [S_0805]

### Nets
GND: C701.2 C702.2 IC701.16(GND) IC702.1(A0) IC702.2(A1) IC702.3(A2) IC702.4(GND) IC702.7(WP) ; also sheet 1,2,3,4,5,6,8,11,12,13,14,16,17,18,19,20,21,22,23,24,25
I2C_SCL: IC702.6(SCL) ; also sheet 10,13,15,17,19
I2C_SDA: IC702.5(SDA) ; also sheet 10,13,15,17,19
MEM_A0: IC701.12(A0) ; also sheet 6,9
MEM_A1: IC701.11(A1) ; also sheet 6,9
MEM_A2: IC701.10(A2) ; also sheet 6,9
MEM_A3: IC701.9(A3) ; also sheet 6,9
MEM_A4: IC701.8(A4) ; also sheet 6,9
MEM_A5: IC701.7(A5) ; also sheet 6,9
MEM_A6: IC701.6(A6) ; also sheet 6,9
MEM_A7: IC701.5(A7) ; also sheet 6,9
MEM_A8: IC701.27(A8) ; also sheet 6,9
MEM_A9: IC701.26(A9) ; also sheet 6,9
MEM_A10: IC701.23(A10) ; also sheet 6,9
MEM_A11: IC701.25(A11) ; also sheet 6,9
MEM_A12: IC701.4(A12) ; also sheet 6,9
MEM_A13: IC701.28(A13) ; also sheet 6,9
MEM_A14: IC701.29(A14) ; also sheet 6,9
MEM_A15: IC701.3(A15) ; also sheet 6,9
MEM_A16: IC701.2(A16) ; also sheet 6,9
MEM_A17: IC701.30(A17) ; also sheet 6,9
MEM_A18: IC701.1(A18) ; also sheet 6,9
MEM_D0: IC701.13(D0) ; also sheet 6,9
MEM_D1: IC701.14(D1) ; also sheet 6,9
MEM_D2: IC701.15(D2) ; also sheet 6,9
MEM_D3: IC701.17(D3) ; also sheet 6,9
MEM_D4: IC701.18(D4) ; also sheet 6,9
MEM_D5: IC701.19(D5) ; also sheet 6,9
MEM_D6: IC701.20(D6) ; also sheet 6,9
MEM_D7: IC701.21(D7) ; also sheet 6,9
P3V3: C701.1 C702.1 IC701.32(VCC) IC702.8(VCC) R701.2 R702.2 R703.2 R704.2 ; also sheet 2,3,4,6,8,9,10,11,12,13,14,16,17,18,19,20,21,22,23,24,25
RAM_IN_CS_N: R701.1 ; also sheet 6,9
RAM_OE_N: IC701.24(OE) ; also sheet 6,9
RAM_OUT_CS_1_N: R702.1 ; also sheet 6,9
RAM_OUT_CS_2_N: R703.1 ; also sheet 6,9
RAM_WE_N: IC701.31(WE) ; also sheet 6,9,17
ROM_CS_N: IC701.22(CE) R704.1 ; also sheet 9

## Sheet 8 of 25
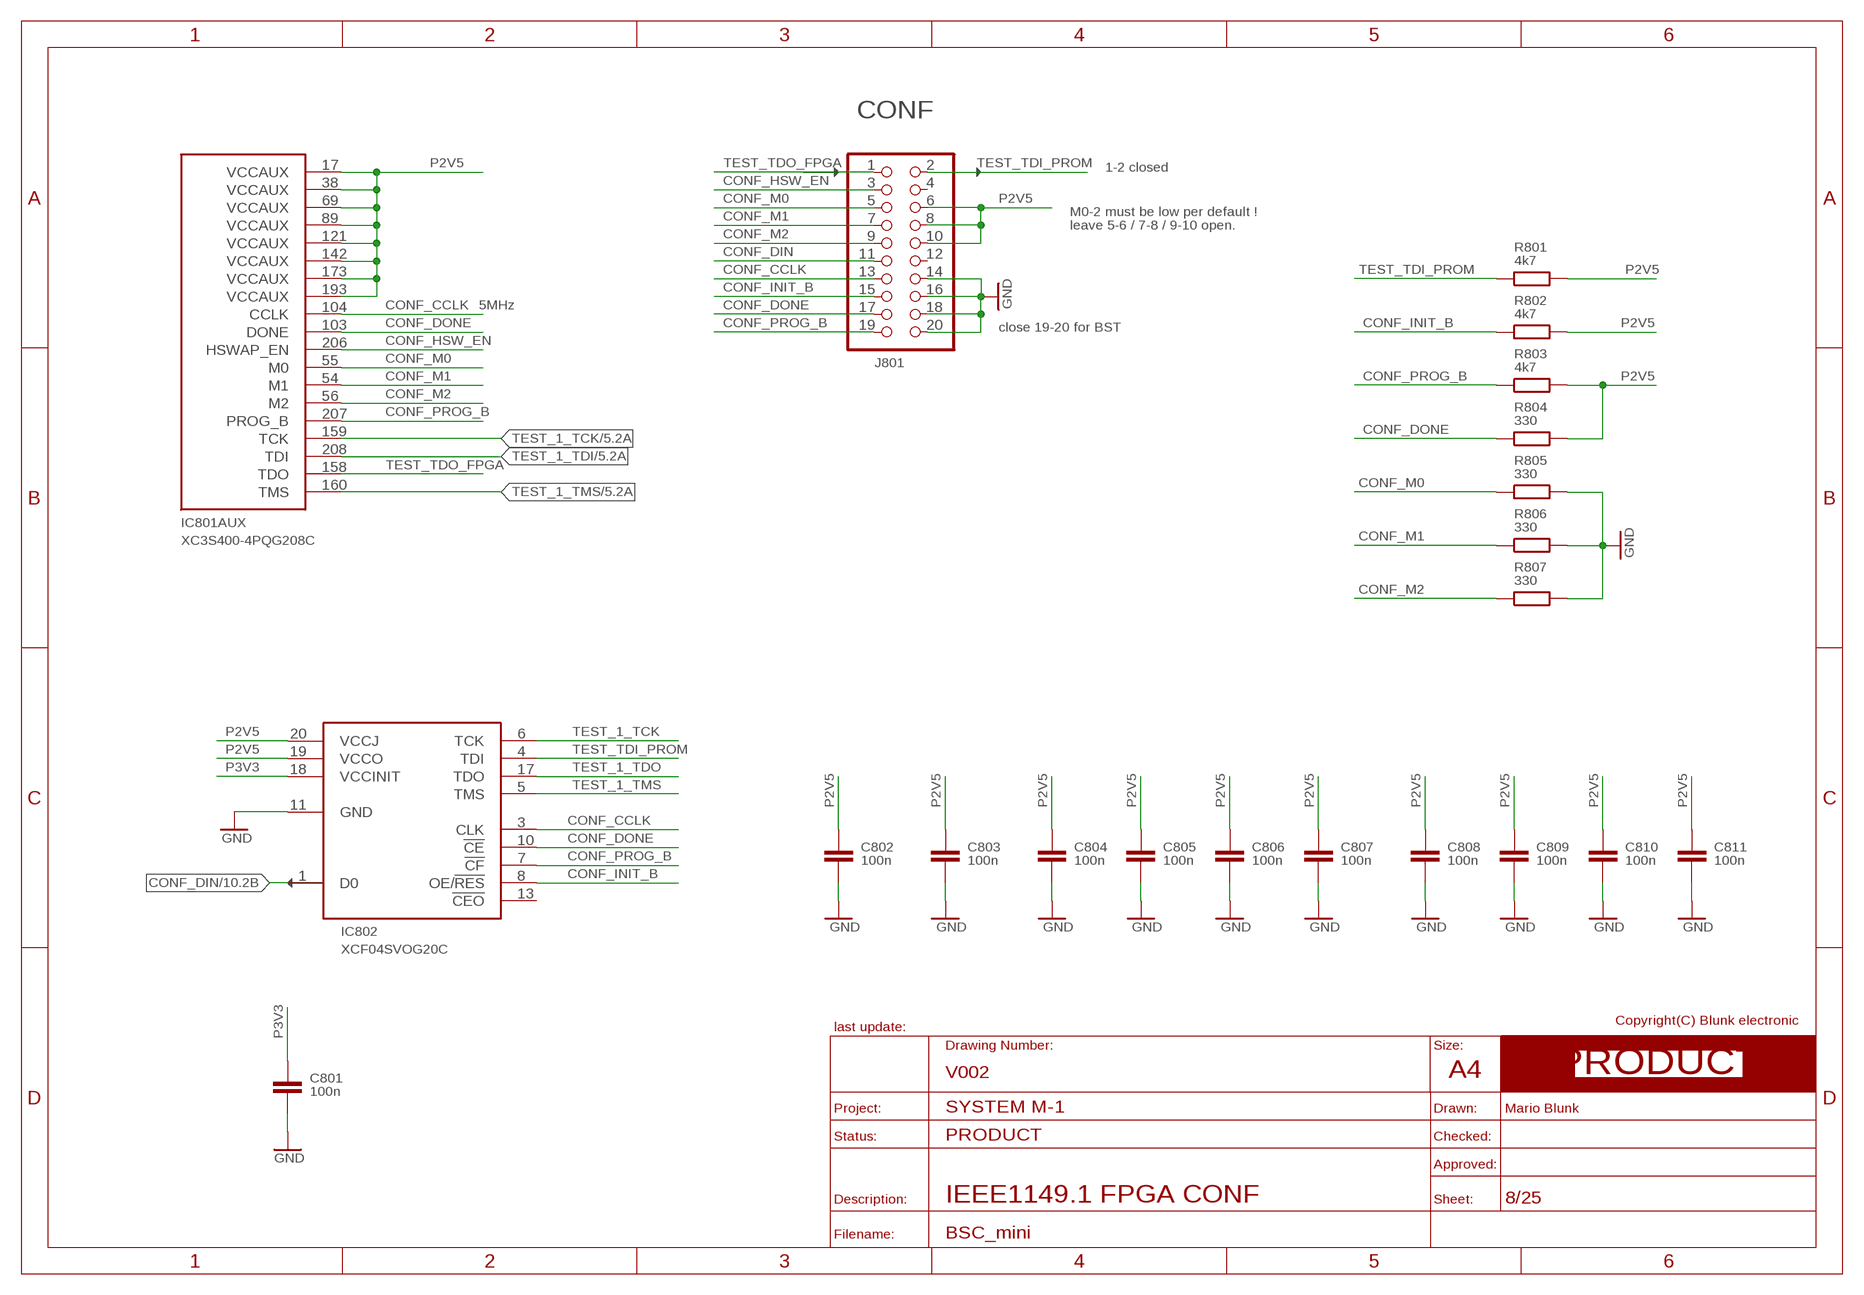
[diagram p7: schematic, sheet 8]
FRAME_PRODUCT13 (A4_LANDSCAPE_PRODUCT): BOM: NO; COMMISSIONED: 2013-08-30; DESCRIPTION: IEEE1149.1 FPGA CONF
U$72 (ARROW_1): BOM: NO; COMMISSIONED: 2013-08-30
U$75 (ARROW_1): BOM: NO; COMMISSIONED: 2013-08-30
U$76 (ARROW_1): BOM: NO; COMMISSIONED: 2013-08-30

### Parts
C801  100n  C_S_0805  [S_0805]
C802  100n  C_S_0805  [S_0805]
C803  100n  C_S_0805  [S_0805]
C804  100n  C_S_0805  [S_0805]
C805  100n  C_S_0805  [S_0805]
C806  100n  C_S_0805  [S_0805]
C807  100n  C_S_0805  [S_0805]
C808  100n  C_S_0805  [S_0805]
C809  100n  C_S_0805  [S_0805]
C810  100n  C_S_0805  [S_0805]
C811  100n  C_S_0805  [S_0805]
IC801  XC3S400-4PQG208C  XC3S400-XPQ208C  [S_PQ208]
IC802  XCF04SVOG20C  XCFXXSVOG20C  [S_TSSOP20]
J801  JUMPER_2X10-T-VERTICAL  [T_MALE_2X10_VERTICAL_GRID_2.54MM]
R801  4k7  R_S_0805  [S_0805]
R802  4k7  R_S_0805  [S_0805]
R803  4k7  R_S_0805  [S_0805]
R804  330  R_S_0805  [S_0805]
R805  330  R_S_0805  [S_0805]
R806  330  R_S_0805  [S_0805]
R807  330  R_S_0805  [S_0805]

### Nets
CONF_CCLK: IC801.104(AUX:CCLK) IC802.3(CLK) J801.13
CONF_DIN: IC802.1(D0) J801.11 ; also sheet 10
CONF_DONE: IC801.103(AUX:DONE) IC802.10(!CE) J801.17 R804.1
CONF_HSW_EN: IC801.206(AUX:HSWAP_EN) J801.3
CONF_INIT_B: IC802.8(OE/!RES) J801.15 R802.1 ; also sheet 10
CONF_M0: IC801.55(AUX:M0) J801.5 R805.1
CONF_M1: IC801.54(AUX:M1) J801.7 R806.1
CONF_M2: IC801.56(AUX:M2) J801.9 R807.1
CONF_PROG_B: IC801.207(AUX:PROG_B) IC802.7(!CF) J801.19 R803.1
GND: C801.2 C802.2 C803.2 C804.2 C805.2 C806.2 C807.2 C808.2 C809.2 C810.2 C811.2 IC802.11(GND) J801.14 J801.16 J801.18 J801.20 R805.2 R806.2 R807.2 ; also sheet 1,2,3,4,5,6,7,11,12,13,14,16,17,18,19,20,21,22,23,24,25
P2V5: C802.1 C803.1 C804.1 C805.1 C806.1 C807.1 C808.1 C809.1 C810.1 C811.1 IC801.17(AUX:VCCAUX) IC801.38(AUX:VCCAUX) IC801.69(AUX:VCCAUX) IC801.89(AUX:VCCAUX) IC801.121(AUX:VCCAUX) IC801.142(AUX:VCCAUX) IC801.173(AUX:VCCAUX) IC801.193(AUX:VCCAUX) IC802.19(VCCO) IC802.20(VCCJ) J801.6 J801.8 J801.10 R801.2 R802.2 R803.2 R804.2 ; also sheet 2,5,10,11
P3V3: C801.1 IC802.18(VCCINIT) ; also sheet 2,3,4,6,7,9,10,11,12,13,14,16,17,18,19,20,21,22,23,24,25
TEST_1_TCK: IC801.159(AUX:TCK) IC802.6(TCK) ; also sheet 5
TEST_1_TDI: IC801.208(AUX:TDI) ; also sheet 5
TEST_1_TDO: IC802.17(TDO) ; also sheet 5
TEST_1_TMS: IC801.160(AUX:TMS) IC802.5(TMS) ; also sheet 5
TEST_TDI_PROM: IC802.4(TDI) J801.2 R801.1
TEST_TDO_FPGA: IC801.158(AUX:TDO) J801.1
Unconnected: IC802.13(!CEO) J801.4 J801.12

### Notes on the sheet
- 1-2 closed
- M0-2 must be low per default !
  leave 5-6 / 7-8 / 9-10 open.
- 5MHz
- close 19-20 for BST

## Sheet 9 of 25
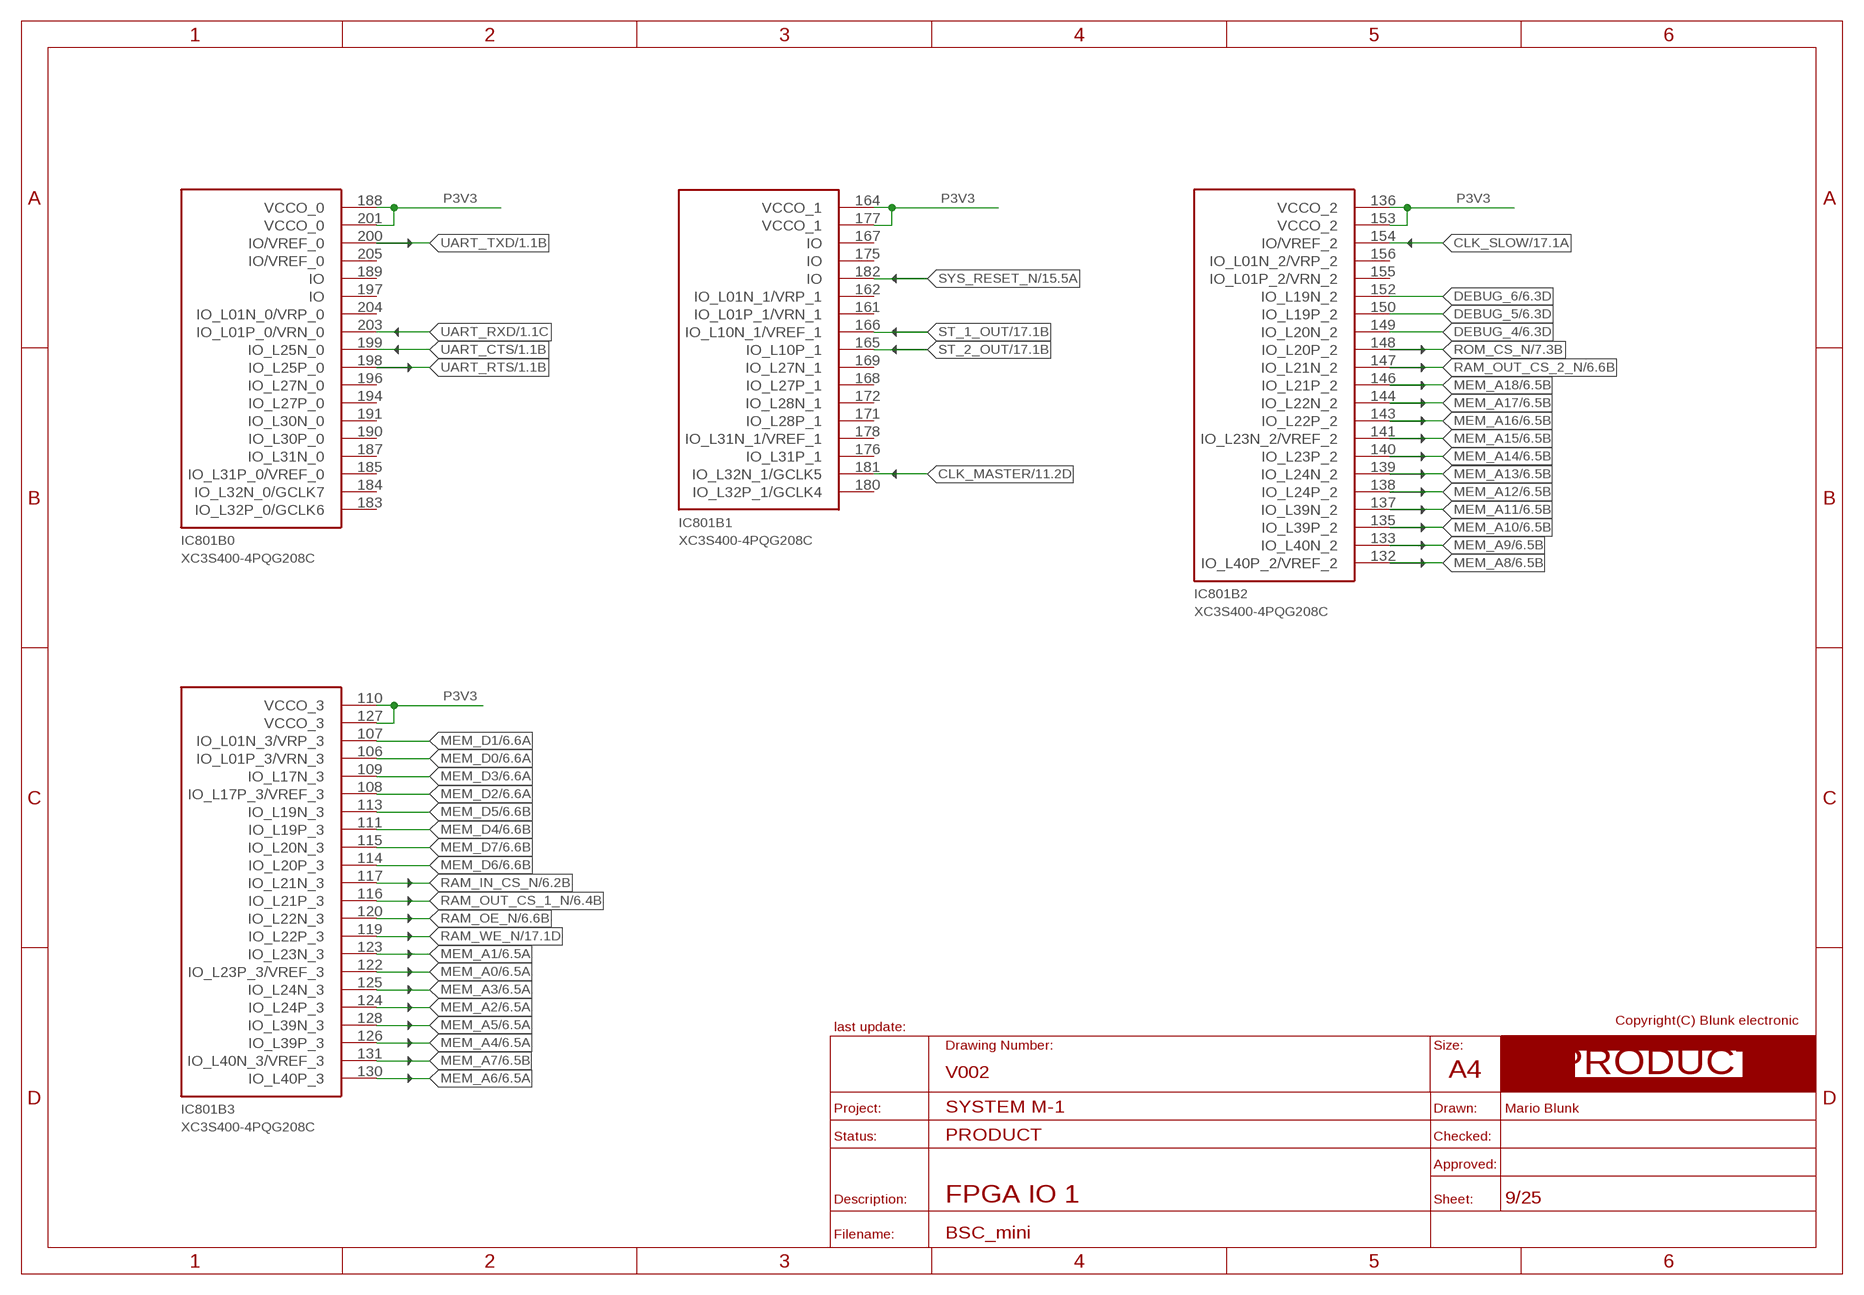
[diagram p8: schematic, sheet 9]
FRAME_PRODUCT11 (A4_LANDSCAPE_PRODUCT): BOM: NO; COMMISSIONED: 2013-08-30; DESCRIPTION: FPGA IO 1
U$35 (ARROW_1): BOM: NO; COMMISSIONED: 2013-08-30
U$36 (ARROW_1): BOM: NO; COMMISSIONED: 2013-08-30
U$37 (ARROW_1): BOM: NO; COMMISSIONED: 2013-08-30
U$38 (ARROW_1): BOM: NO; COMMISSIONED: 2013-08-30
U$39 (ARROW_1): BOM: NO; COMMISSIONED: 2013-08-30
U$43 (ARROW_1): BOM: NO; COMMISSIONED: 2013-08-30
U$44 (ARROW_1): BOM: NO; COMMISSIONED: 2013-08-30
U$45 (ARROW_1): BOM: NO; COMMISSIONED: 2013-08-30
U$46 (ARROW_1): BOM: NO; COMMISSIONED: 2013-08-30
U$47 (ARROW_1): BOM: NO; COMMISSIONED: 2013-08-30
U$48 (ARROW_1): BOM: NO; COMMISSIONED: 2013-08-30
U$49 (ARROW_1): BOM: NO; COMMISSIONED: 2013-08-30
U$50 (ARROW_1): BOM: NO; COMMISSIONED: 2013-08-30
U$51 (ARROW_1): BOM: NO; COMMISSIONED: 2013-08-30
U$52 (ARROW_1): BOM: NO; COMMISSIONED: 2013-08-30
U$53 (ARROW_1): BOM: NO; COMMISSIONED: 2013-08-30
U$54 (ARROW_1): BOM: NO; COMMISSIONED: 2013-08-30
U$55 (ARROW_1): BOM: NO; COMMISSIONED: 2013-08-30
U$56 (ARROW_1): BOM: NO; COMMISSIONED: 2013-08-30
U$57 (ARROW_1): BOM: NO; COMMISSIONED: 2013-08-30
U$58 (ARROW_1): BOM: NO; COMMISSIONED: 2013-08-30
U$59 (ARROW_1): BOM: NO; COMMISSIONED: 2013-08-30
U$60 (ARROW_1): BOM: NO; COMMISSIONED: 2013-08-30
U$61 (ARROW_1): BOM: NO; COMMISSIONED: 2013-08-30
U$62 (ARROW_1): BOM: NO; COMMISSIONED: 2013-08-30
U$63 (ARROW_1): BOM: NO; COMMISSIONED: 2013-08-30
U$64 (ARROW_1): BOM: NO; COMMISSIONED: 2013-08-30
U$65 (ARROW_1): BOM: NO; COMMISSIONED: 2013-08-30
U$66 (ARROW_1): BOM: NO; COMMISSIONED: 2013-08-30
U$67 (ARROW_1): BOM: NO; COMMISSIONED: 2013-08-30
U$68 (ARROW_1): BOM: NO; COMMISSIONED: 2013-08-30
U$69 (ARROW_1): BOM: NO; COMMISSIONED: 2013-08-30
U$70 (ARROW_1): BOM: NO; COMMISSIONED: 2013-08-30
U$71 (ARROW_1): BOM: NO; COMMISSIONED: 2013-08-30

### Nets
CLK_MASTER: IC801.181(B1:IO_L32N_1/GCLK5) ; also sheet 11
CLK_SLOW: IC801.154(B2:IO/VREF_2) ; also sheet 4,17
DEBUG_4: IC801.149(B2:IO_L20N_2) ; also sheet 6
DEBUG_5: IC801.150(B2:IO_L19P_2) ; also sheet 6
DEBUG_6: IC801.152(B2:IO_L19N_2) ; also sheet 6
MEM_A0: IC801.122(B3:IO_L23P_3/VREF_3) ; also sheet 6,7
MEM_A1: IC801.123(B3:IO_L23N_3) ; also sheet 6,7
MEM_A2: IC801.124(B3:IO_L24P_3) ; also sheet 6,7
MEM_A3: IC801.125(B3:IO_L24N_3) ; also sheet 6,7
MEM_A4: IC801.126(B3:IO_L39P_3) ; also sheet 6,7
MEM_A5: IC801.128(B3:IO_L39N_3) ; also sheet 6,7
MEM_A6: IC801.130(B3:IO_L40P_3) ; also sheet 6,7
MEM_A7: IC801.131(B3:IO_L40N_3/VREF_3) ; also sheet 6,7
MEM_A8: IC801.132(B2:IO_L40P_2/VREF_2) ; also sheet 6,7
MEM_A9: IC801.133(B2:IO_L40N_2) ; also sheet 6,7
MEM_A10: IC801.135(B2:IO_L39P_2) ; also sheet 6,7
MEM_A11: IC801.137(B2:IO_L39N_2) ; also sheet 6,7
MEM_A12: IC801.138(B2:IO_L24P_2) ; also sheet 6,7
MEM_A13: IC801.139(B2:IO_L24N_2) ; also sheet 6,7
MEM_A14: IC801.140(B2:IO_L23P_2) ; also sheet 6,7
MEM_A15: IC801.141(B2:IO_L23N_2/VREF_2) ; also sheet 6,7
MEM_A16: IC801.143(B2:IO_L22P_2) ; also sheet 6,7
MEM_A17: IC801.144(B2:IO_L22N_2) ; also sheet 6,7
MEM_A18: IC801.146(B2:IO_L21P_2) ; also sheet 6,7
MEM_D0: IC801.106(B3:IO_L01P_3/VRN_3) ; also sheet 6,7
MEM_D1: IC801.107(B3:IO_L01N_3/VRP_3) ; also sheet 6,7
MEM_D2: IC801.108(B3:IO_L17P_3/VREF_3) ; also sheet 6,7
MEM_D3: IC801.109(B3:IO_L17N_3) ; also sheet 6,7
MEM_D4: IC801.111(B3:IO_L19P_3) ; also sheet 6,7
MEM_D5: IC801.113(B3:IO_L19N_3) ; also sheet 6,7
MEM_D6: IC801.114(B3:IO_L20P_3) ; also sheet 6,7
MEM_D7: IC801.115(B3:IO_L20N_3) ; also sheet 6,7
P3V3: IC801.110(B3:VCCO_3) IC801.127(B3:VCCO_3) IC801.136(B2:VCCO_2) IC801.153(B2:VCCO_2) IC801.164(B1:VCCO_1) IC801.177(B1:VCCO_1) IC801.188(B0:VCCO_0) IC801.201(B0:VCCO_0) ; also sheet 2,3,4,6,7,8,10,11,12,13,14,16,17,18,19,20,21,22,23,24,25
RAM_IN_CS_N: IC801.117(B3:IO_L21N_3) ; also sheet 6,7
RAM_OE_N: IC801.120(B3:IO_L22N_3) ; also sheet 6,7
RAM_OUT_CS_1_N: IC801.116(B3:IO_L21P_3) ; also sheet 6,7
RAM_OUT_CS_2_N: IC801.147(B2:IO_L21N_2) ; also sheet 6,7
RAM_WE_N: IC801.119(B3:IO_L22P_3) ; also sheet 6,7,17
ROM_CS_N: IC801.148(B2:IO_L20P_2) ; also sheet 7
ST_1_OUT: IC801.166(B1:IO_L10N_1/VREF_1) ; also sheet 4,17
ST_2_OUT: IC801.165(B1:IO_L10P_1) ; also sheet 4,17
SYS_RESET_N: IC801.182(B1:IO) ; also sheet 4,15,17
UART_CTS: IC801.199(B0:IO_L25N_0) ; also sheet 1
UART_RTS: IC801.198(B0:IO_L25P_0) ; also sheet 1
UART_RXD: IC801.203(B0:IO_L01P_0/VRN_0) ; also sheet 1
UART_TXD: IC801.200(B0:IO/VREF_0) ; also sheet 1
Unconnected: IC801.155(B2:IO_L01P_2/VRN_2) IC801.156(B2:IO_L01N_2/VRP_2) IC801.161(B1:IO_L01P_1/VRN_1) IC801.162(B1:IO_L01N_1/VRP_1) IC801.167(B1:IO) IC801.168(B1:IO_L27P_1) IC801.169(B1:IO_L27N_1) IC801.171(B1:IO_L28P_1) IC801.172(B1:IO_L28N_1) IC801.175(B1:IO) IC801.176(B1:IO_L31P_1) IC801.178(B1:IO_L31N_1/VREF_1) IC801.180(B1:IO_L32P_1/GCLK4) IC801.183(B0:IO_L32P_0/GCLK6) IC801.184(B0:IO_L32N_0/GCLK7) IC801.185(B0:IO_L31P_0/VREF_0) IC801.187(B0:IO_L31N_0) IC801.189(B0:IO) IC801.190(B0:IO_L30P_0) IC801.191(B0:IO_L30N_0) IC801.194(B0:IO_L27P_0) IC801.196(B0:IO_L27N_0) IC801.197(B0:IO) IC801.204(B0:IO_L01N_0/VRP_0) IC801.205(B0:IO/VREF_0)

## Sheet 10 of 25
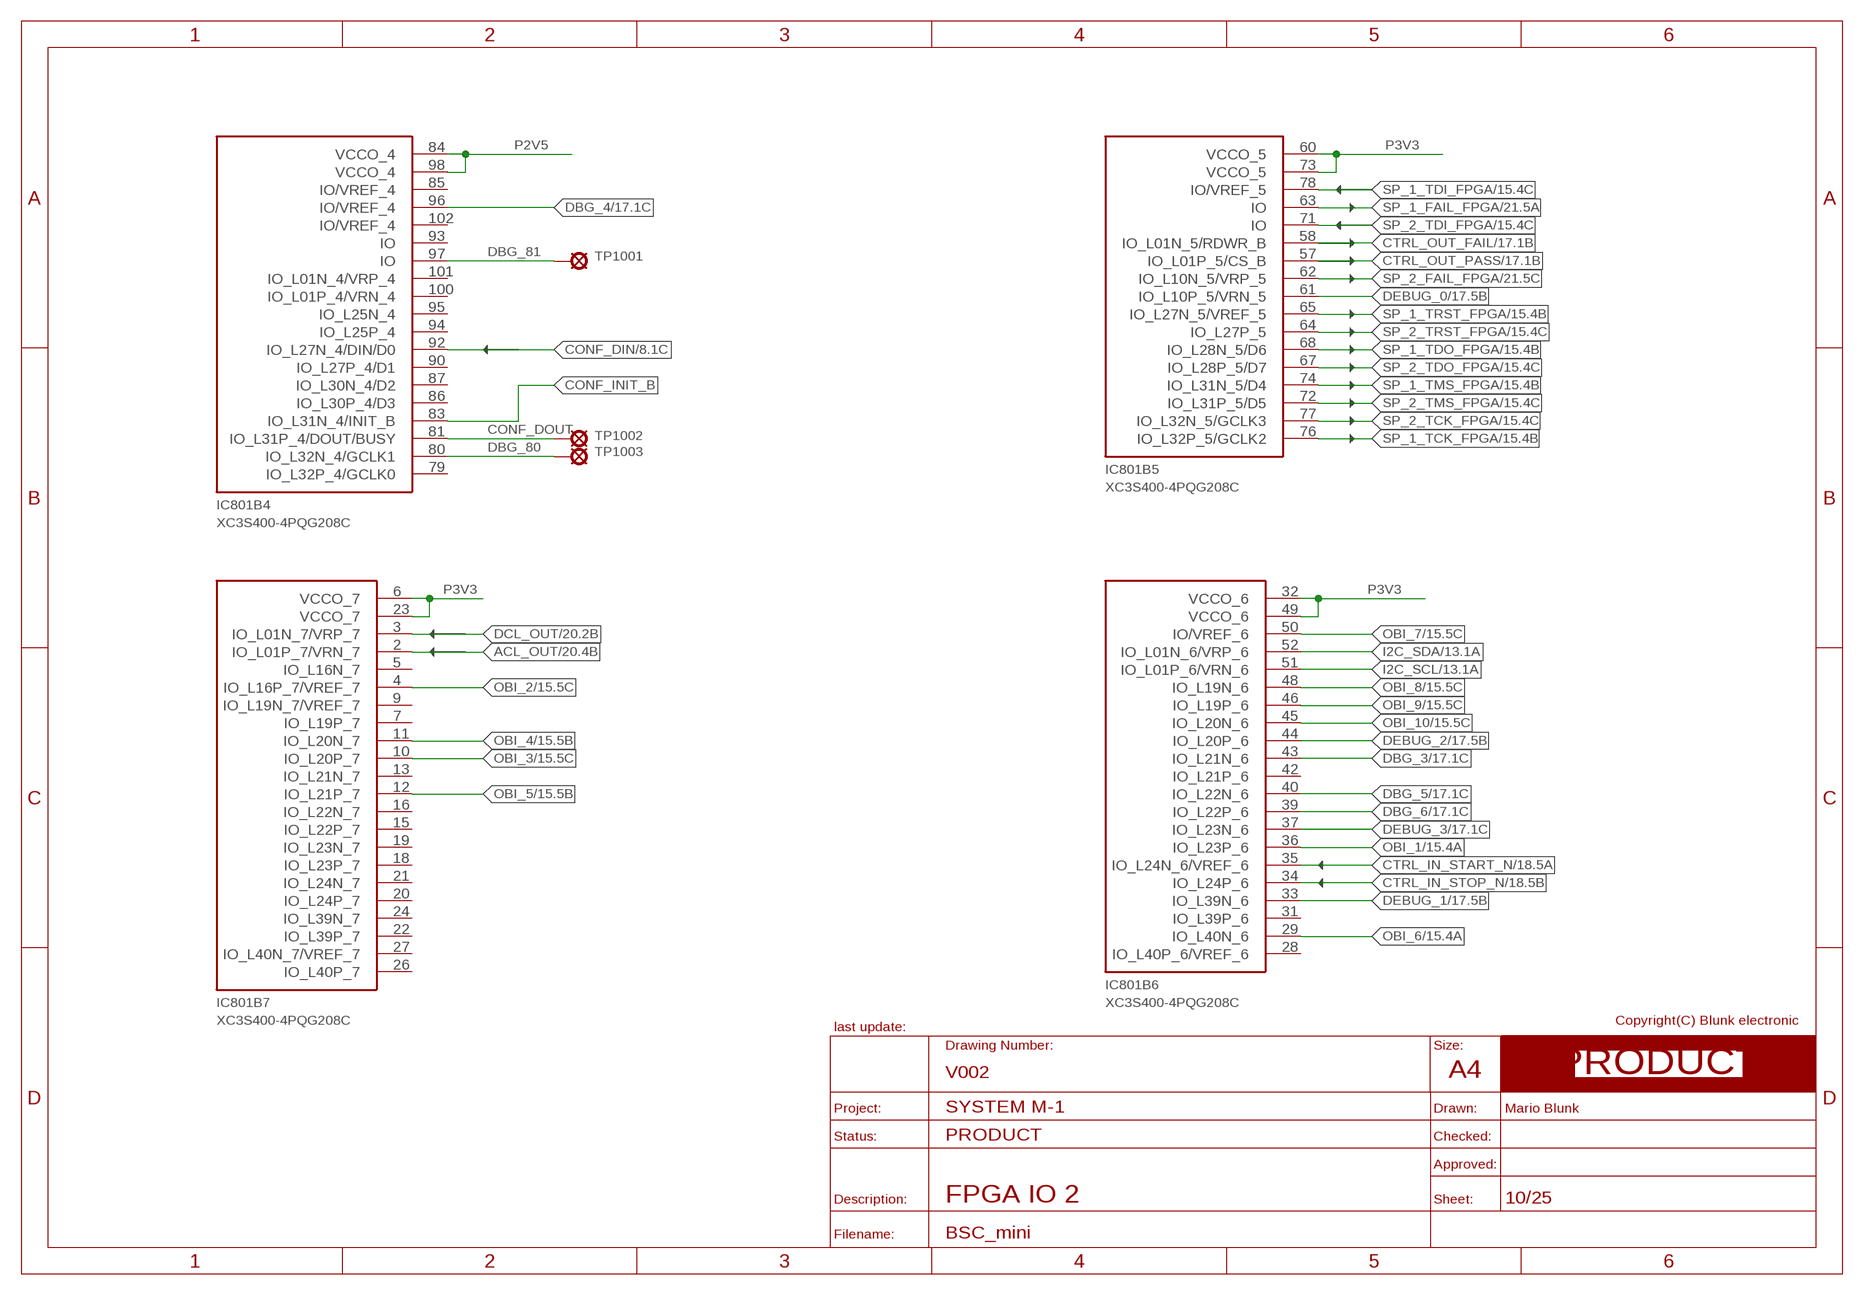
[diagram p9: schematic, sheet 10]
FRAME_PRODUCT12 (A4_LANDSCAPE_PRODUCT): BOM: NO; COMMISSIONED: 2013-08-30; DESCRIPTION: FPGA IO 2
U$73 (ARROW_1): BOM: NO; COMMISSIONED: 2013-08-30
U$74 (ARROW_1): BOM: NO; COMMISSIONED: 2013-08-30
U$77 (ARROW_1): BOM: NO; COMMISSIONED: 2013-08-30
U$78 (ARROW_1): BOM: NO; COMMISSIONED: 2013-08-30
U$79 (ARROW_1): BOM: NO; COMMISSIONED: 2013-08-30
U$80 (ARROW_1): BOM: NO; COMMISSIONED: 2013-08-30
U$81 (ARROW_1): BOM: NO; COMMISSIONED: 2013-08-30
U$82 (ARROW_1): BOM: NO; COMMISSIONED: 2013-08-30
U$83 (ARROW_1): BOM: NO; COMMISSIONED: 2013-08-30
U$84 (ARROW_1): BOM: NO; COMMISSIONED: 2013-08-30
U$85 (ARROW_1): BOM: NO; COMMISSIONED: 2013-08-30
U$86 (ARROW_1): BOM: NO; COMMISSIONED: 2013-08-30
U$87 (ARROW_1): BOM: NO; COMMISSIONED: 2013-08-30
U$88 (ARROW_1): BOM: NO; COMMISSIONED: 2013-08-30
U$89 (ARROW_1): BOM: NO; COMMISSIONED: 2013-08-30
U$90 (ARROW_1): BOM: NO; COMMISSIONED: 2013-08-30
U$91 (ARROW_1): BOM: NO; COMMISSIONED: 2013-08-30
U$92 (ARROW_1): BOM: NO; COMMISSIONED: 2013-08-30
U$93 (ARROW_1): BOM: NO; COMMISSIONED: 2013-08-30

### Parts
TP1001  TEST_POINT_T_SMALL  [T_TEST_POINT_SMALL]
TP1002  TEST_POINT_T_SMALL  [T_TEST_POINT_SMALL]
TP1003  TEST_POINT_T_SMALL  [T_TEST_POINT_SMALL]

### Nets
ACL_OUT: IC801.2(B7:IO_L01P_7/VRN_7) ; also sheet 20
CONF_DIN: IC801.92(B4:IO_L27N_4/DIN/D0) ; also sheet 8
CONF_DOUT: IC801.81(B4:IO_L31P_4/DOUT/BUSY) TP1002.1(TP)
CONF_INIT_B: IC801.83(B4:IO_L31N_4/INIT_B) ; also sheet 8
CTRL_IN_START_N: IC801.35(B6:IO_L24N_6/VREF_6) ; also sheet 18
CTRL_IN_STOP_N: IC801.34(B6:IO_L24P_6) ; also sheet 18
CTRL_OUT_FAIL: IC801.58(B5:IO_L01N_5/RDWR_B) ; also sheet 17,18
CTRL_OUT_PASS: IC801.57(B5:IO_L01P_5/CS_B) ; also sheet 17,18
DBG_3: IC801.43(B6:IO_L21N_6) ; also sheet 17
DBG_4: IC801.96(B4:IO/VREF_4) ; also sheet 17
DBG_5: IC801.40(B6:IO_L22N_6) ; also sheet 17
DBG_6: IC801.39(B6:IO_L22P_6) ; also sheet 17
DBG_80: IC801.80(B4:IO_L32N_4/GCLK1) TP1003.1(TP)
DBG_81: IC801.97(B4:IO) TP1001.1(TP)
DCL_OUT: IC801.3(B7:IO_L01N_7/VRP_7) ; also sheet 20
DEBUG_0: IC801.61(B5:IO_L10P_5/VRN_5) ; also sheet 17
DEBUG_1: IC801.33(B6:IO_L39N_6) ; also sheet 17
DEBUG_2: IC801.44(B6:IO_L20P_6) ; also sheet 17
DEBUG_3: IC801.37(B6:IO_L23N_6) ; also sheet 17
I2C_SCL: IC801.51(B6:IO_L01P_6/VRN_6) ; also sheet 7,13,15,17,19
I2C_SDA: IC801.52(B6:IO_L01N_6/VRP_6) ; also sheet 7,13,15,17,19
OBI_1: IC801.36(B6:IO_L23P_6) ; also sheet 15
OBI_2: IC801.4(B7:IO_L16P_7/VREF_7) ; also sheet 15,19
OBI_3: IC801.10(B7:IO_L20P_7) ; also sheet 15,19
OBI_4: IC801.11(B7:IO_L20N_7) ; also sheet 15,19
OBI_5: IC801.12(B7:IO_L21P_7) ; also sheet 15,19
OBI_6: IC801.29(B6:IO_L40N_6) ; also sheet 15
OBI_7: IC801.50(B6:IO/VREF_6) ; also sheet 6,15
OBI_8: IC801.48(B6:IO_L19N_6) ; also sheet 6,15
OBI_9: IC801.46(B6:IO_L19P_6) ; also sheet 6,15
OBI_10: IC801.45(B6:IO_L20N_6) ; also sheet 6,15
P2V5: IC801.84(B4:VCCO_4) IC801.98(B4:VCCO_4) ; also sheet 2,5,8,11
P3V3: IC801.6(B7:VCCO_7) IC801.23(B7:VCCO_7) IC801.32(B6:VCCO_6) IC801.49(B6:VCCO_6) IC801.60(B5:VCCO_5) IC801.73(B5:VCCO_5) ; also sheet 2,3,4,6,7,8,9,11,12,13,14,16,17,18,19,20,21,22,23,24,25
SP_1_FAIL_FPGA: IC801.63(B5:IO) ; also sheet 6,21
SP_1_TCK_FPGA: IC801.76(B5:IO_L32P_5/GCLK2) ; also sheet 15
SP_1_TDI_FPGA: IC801.78(B5:IO/VREF_5) ; also sheet 6,15
SP_1_TDO_FPGA: IC801.68(B5:IO_L28N_5/D6) ; also sheet 15
SP_1_TMS_FPGA: IC801.74(B5:IO_L31N_5/D4) ; also sheet 15
SP_1_TRST_FPGA: IC801.65(B5:IO_L27N_5/VREF_5) ; also sheet 15
SP_2_FAIL_FPGA: IC801.62(B5:IO_L10N_5/VRP_5) ; also sheet 6,21
SP_2_TCK_FPGA: IC801.77(B5:IO_L32N_5/GCLK3) ; also sheet 15
SP_2_TDI_FPGA: IC801.71(B5:IO) ; also sheet 6,15
SP_2_TDO_FPGA: IC801.67(B5:IO_L28P_5/D7) ; also sheet 15
SP_2_TMS_FPGA: IC801.72(B5:IO_L31P_5/D5) ; also sheet 15
SP_2_TRST_FPGA: IC801.64(B5:IO_L27P_5) ; also sheet 15
Unconnected: IC801.5(B7:IO_L16N_7) IC801.7(B7:IO_L19P_7) IC801.9(B7:IO_L19N_7/VREF_7) IC801.13(B7:IO_L21N_7) IC801.15(B7:IO_L22P_7) IC801.16(B7:IO_L22N_7) IC801.18(B7:IO_L23P_7) IC801.19(B7:IO_L23N_7) IC801.20(B7:IO_L24P_7) IC801.21(B7:IO_L24N_7) IC801.22(B7:IO_L39P_7) IC801.24(B7:IO_L39N_7) IC801.26(B7:IO_L40P_7) IC801.27(B7:IO_L40N_7/VREF_7) IC801.28(B6:IO_L40P_6/VREF_6) IC801.31(B6:IO_L39P_6) IC801.42(B6:IO_L21P_6) IC801.79(B4:IO_L32P_4/GCLK0) IC801.85(B4:IO/VREF_4) IC801.86(B4:IO_L30P_4/D3) IC801.87(B4:IO_L30N_4/D2) IC801.90(B4:IO_L27P_4/D1) IC801.93(B4:IO) IC801.94(B4:IO_L25P_4) IC801.95(B4:IO_L25N_4) IC801.100(B4:IO_L01P_4/VRN_4) IC801.101(B4:IO_L01N_4/VRP_4) IC801.102(B4:IO/VREF_4)

## Sheet 11 of 25
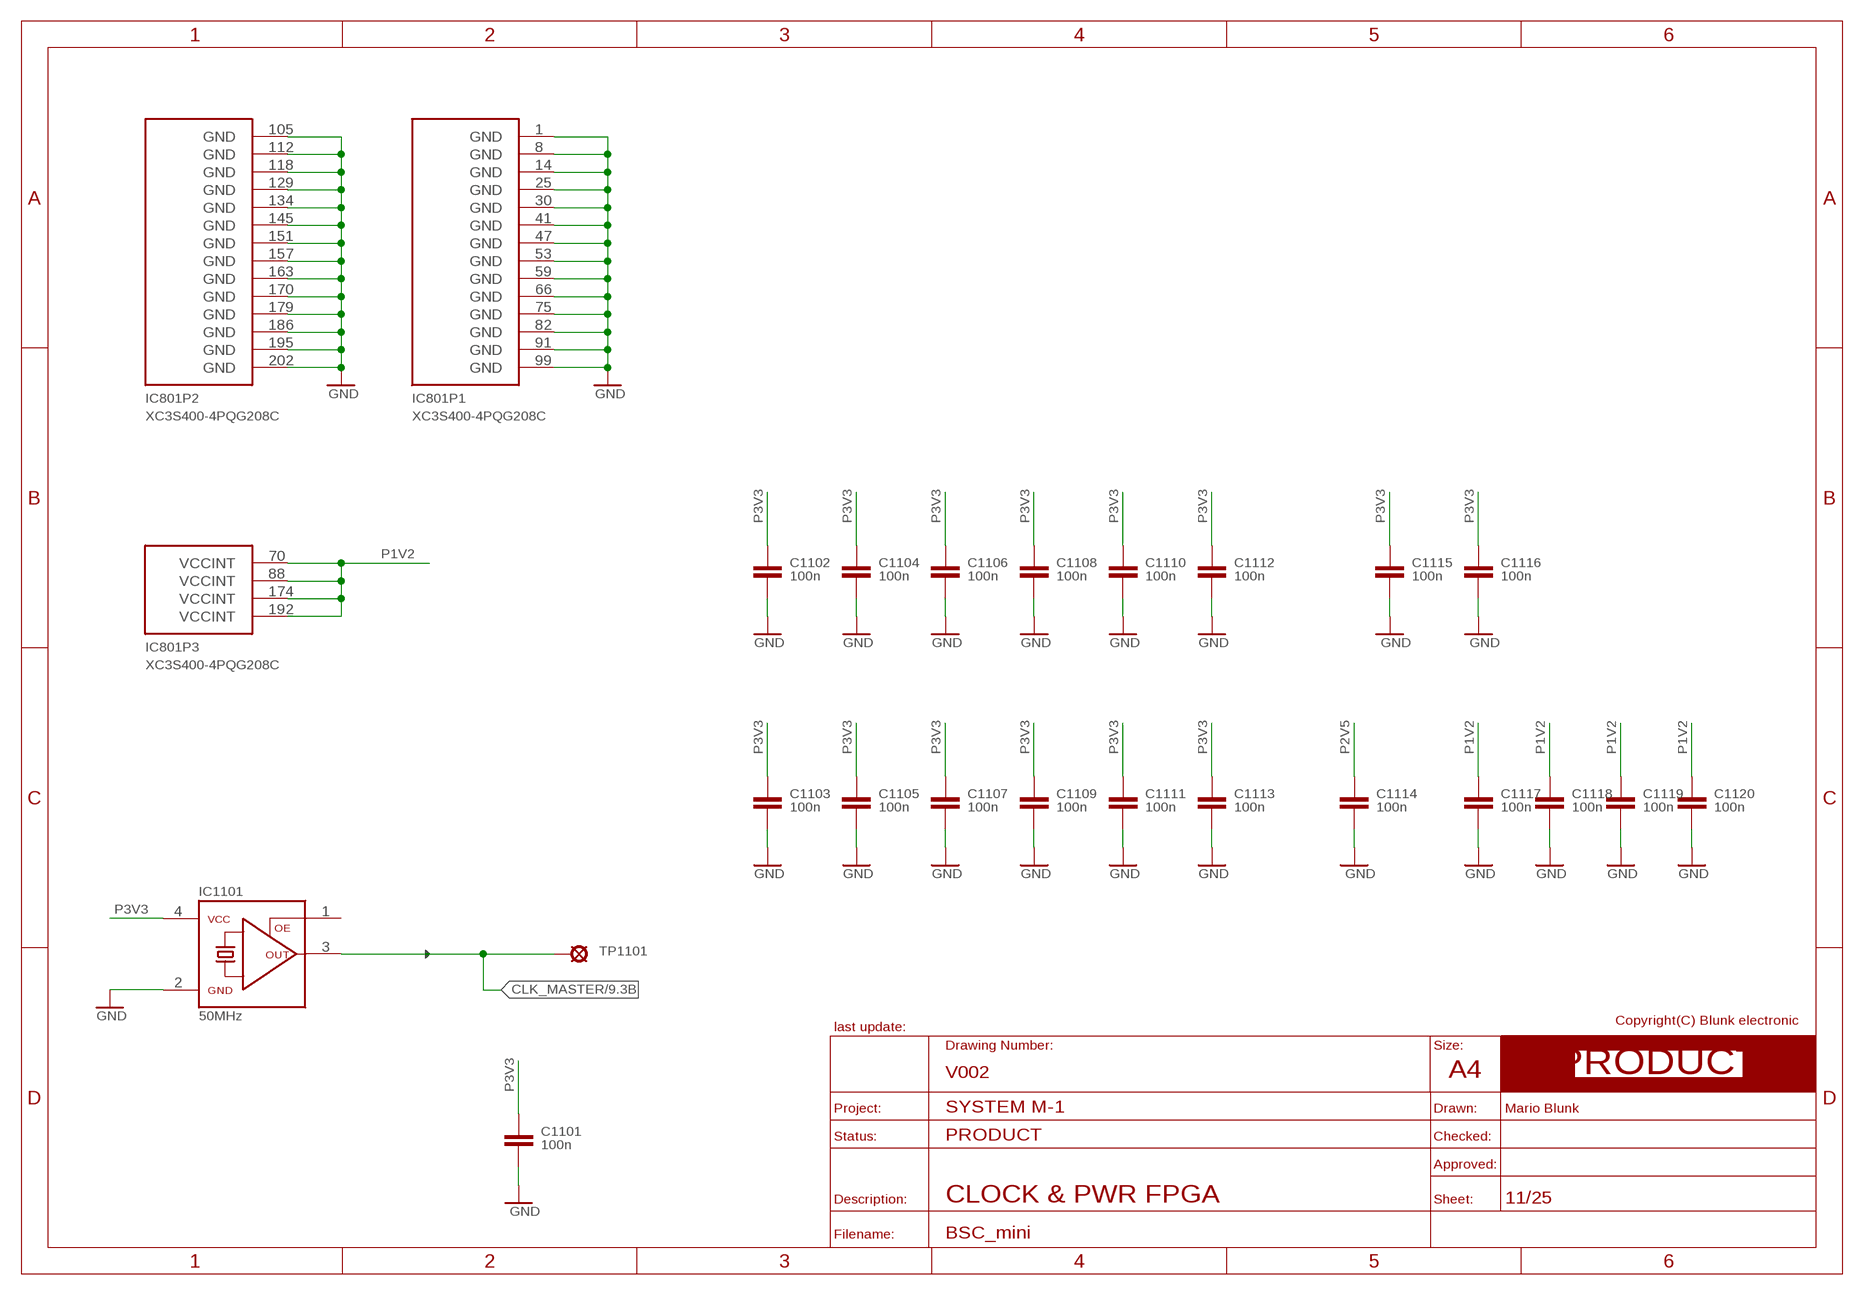
[diagram p10: schematic, sheet 11]
FRAME_PRODUCT10 (A4_LANDSCAPE_PRODUCT): BOM: NO; COMMISSIONED: 2013-08-30; DESCRIPTION: CLOCK & PWR FPGA
U$94 (ARROW_1): BOM: NO; COMMISSIONED: 2013-08-30

### Parts
C1101  100n  C_S_0805  [S_0805]
C1102  100n  C_S_0805  [S_0805]
C1103  100n  C_S_0805  [S_0805]
C1104  100n  C_S_0805  [S_0805]
C1105  100n  C_S_0805  [S_0805]
C1106  100n  C_S_0805  [S_0805]
C1107  100n  C_S_0805  [S_0805]
C1108  100n  C_S_0805  [S_0805]
C1109  100n  C_S_0805  [S_0805]
C1110  100n  C_S_0805  [S_0805]
C1111  100n  C_S_0805  [S_0805]
C1112  100n  C_S_0805  [S_0805]
C1113  100n  C_S_0805  [S_0805]
C1114  100n  C_S_0805  [S_0805]
C1115  100n  C_S_0805  [S_0805]
C1116  100n  C_S_0805  [S_0805]
C1117  100n  C_S_0805  [S_0805]
C1118  100n  C_S_0805  [S_0805]
C1119  100n  C_S_0805  [S_0805]
C1120  100n  C_S_0805  [S_0805]
IC1101  50MHz  OSC_S_XO91  [S_XO91]
TP1101  TEST_POINT_T_SMALL  [T_TEST_POINT_SMALL]

### Nets
CLK_MASTER: IC1101.3(FO) TP1101.1(TP) ; also sheet 9
GND: C1101.2 C1102.2 C1103.2 C1104.2 C1105.2 C1106.2 C1107.2 C1108.2 C1109.2 C1110.2 C1111.2 C1112.2 C1113.2 C1114.2 C1115.2 C1116.2 C1117.2 C1118.2 C1119.2 C1120.2 IC801.1(P1:GND) IC801.8(P1:GND) IC801.14(P1:GND) IC801.25(P1:GND) IC801.30(P1:GND) IC801.41(P1:GND) IC801.47(P1:GND) IC801.53(P1:GND) IC801.59(P1:GND) IC801.66(P1:GND) IC801.75(P1:GND) IC801.82(P1:GND) IC801.91(P1:GND) IC801.99(P1:GND) IC801.105(P2:GND) IC801.112(P2:GND) IC801.118(P2:GND) IC801.129(P2:GND) IC801.134(P2:GND) IC801.145(P2:GND) IC801.151(P2:GND) IC801.157(P2:GND) IC801.163(P2:GND) IC801.170(P2:GND) IC801.179(P2:GND) IC801.186(P2:GND) IC801.195(P2:GND) IC801.202(P2:GND) IC1101.2(GND) ; also sheet 1,2,3,4,5,6,7,8,12,13,14,16,17,18,19,20,21,22,23,24,25
P1V2: C1117.1 C1118.1 C1119.1 C1120.1 IC801.70(P3:VCCINT) IC801.88(P3:VCCINT) IC801.174(P3:VCCINT) IC801.192(P3:VCCINT) ; also sheet 2
P2V5: C1114.1 ; also sheet 2,5,8,10
P3V3: C1101.1 C1102.1 C1103.1 C1104.1 C1105.1 C1106.1 C1107.1 C1108.1 C1109.1 C1110.1 C1111.1 C1112.1 C1113.1 C1115.1 C1116.1 IC1101.4(VCC) ; also sheet 2,3,4,6,7,8,9,10,12,13,14,16,17,18,19,20,21,22,23,24,25
Unconnected: IC1101.1(OE)

## Sheet 12 of 25
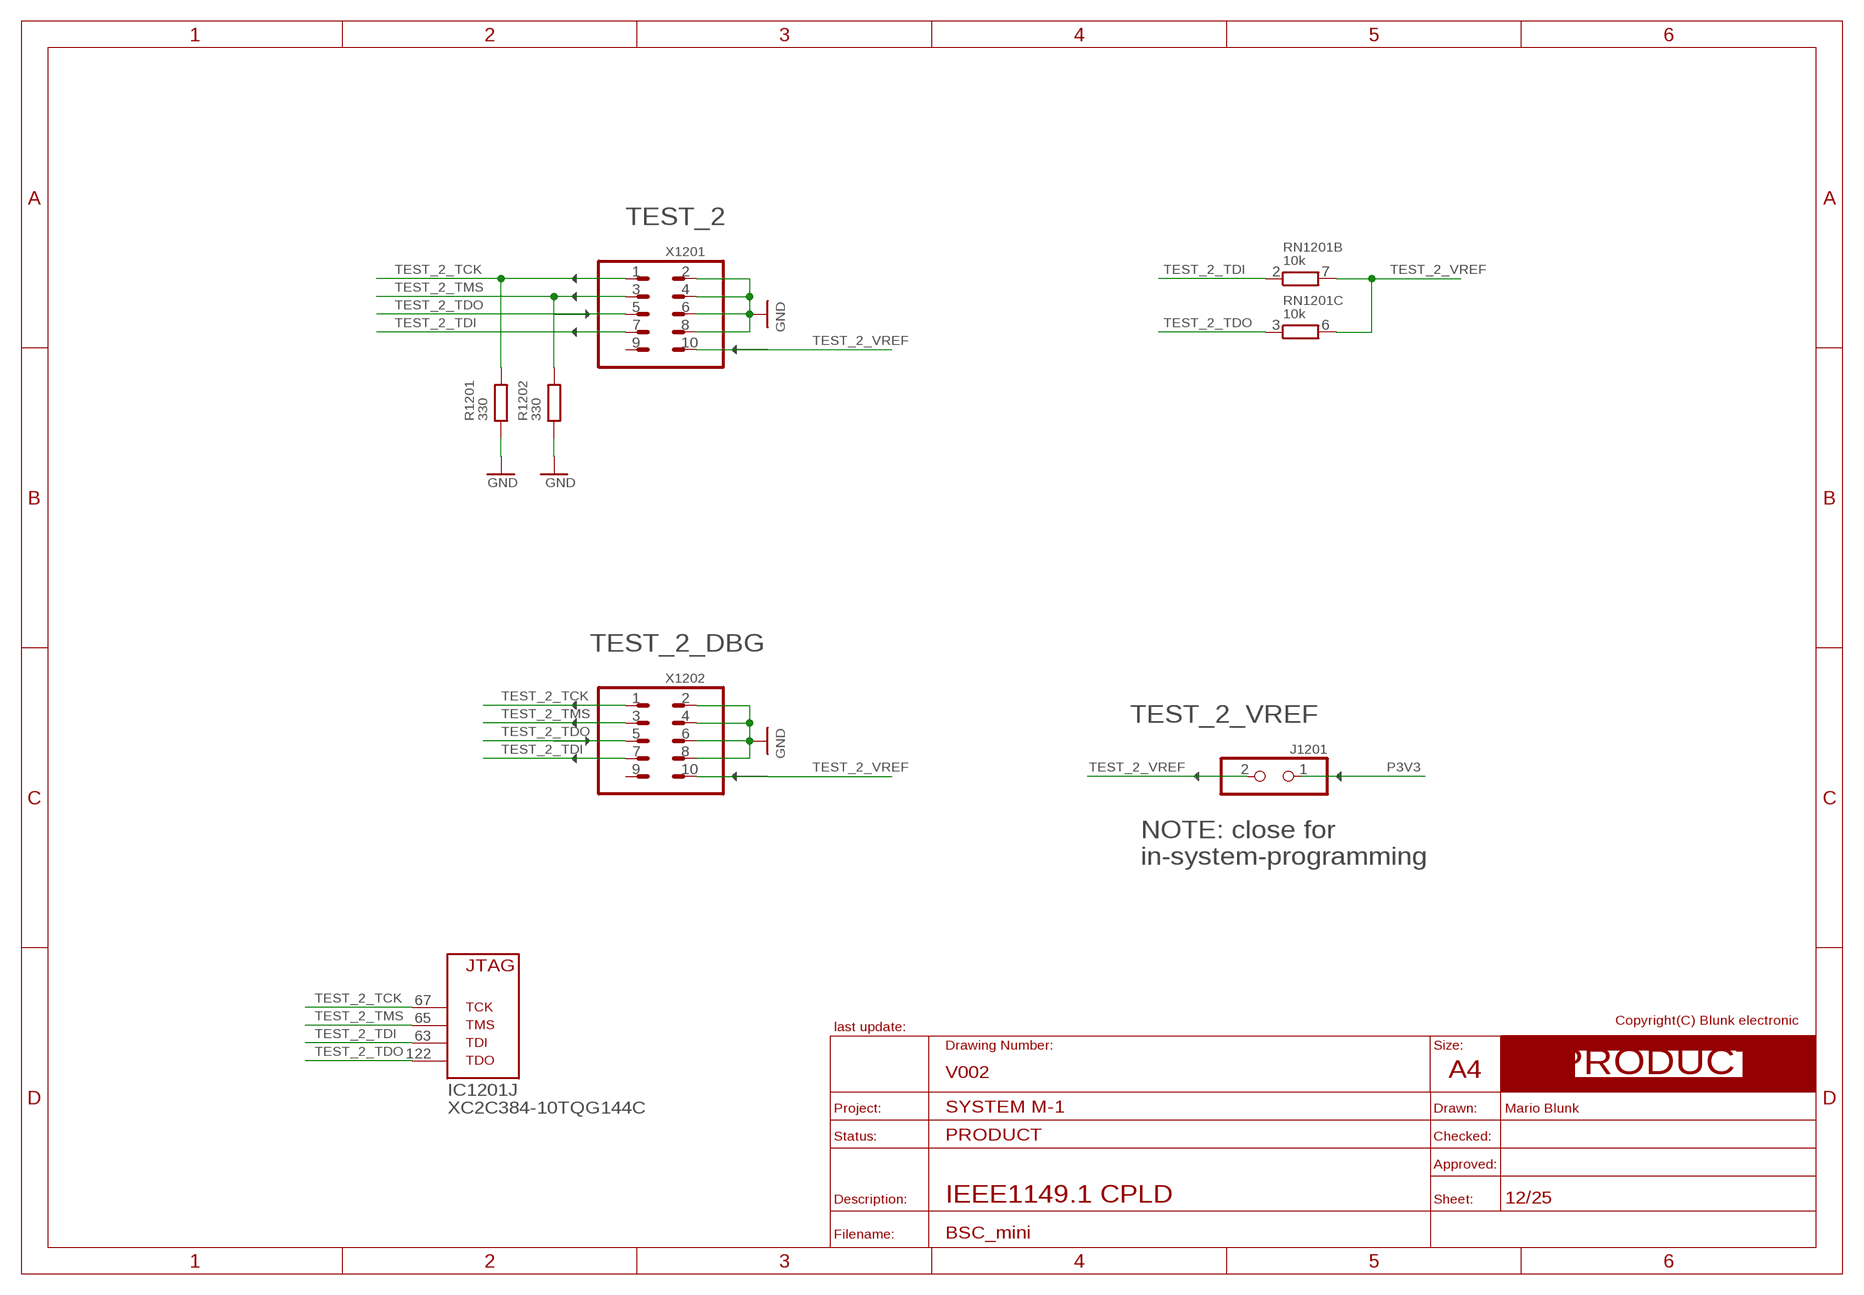
[diagram p11: schematic, sheet 12]
FRAME_PRODUCT15 (A4_LANDSCAPE_PRODUCT): BOM: NO; COMMISSIONED: 2013-08-30; DESCRIPTION: IEEE1149.1 CPLD
U$25 (ARROW_1): BOM: NO; COMMISSIONED: 2013-08-30
U$26 (ARROW_1): BOM: NO; COMMISSIONED: 2013-08-30
U$27 (ARROW_1): BOM: NO; COMMISSIONED: 2013-08-30
U$28 (ARROW_1): BOM: NO; COMMISSIONED: 2013-08-30
U$29 (ARROW_1): BOM: NO; COMMISSIONED: 2013-08-30
U$30 (ARROW_1): BOM: NO; COMMISSIONED: 2013-08-30
U$31 (ARROW_1): BOM: NO; COMMISSIONED: 2013-08-30
U$32 (ARROW_1): BOM: NO; COMMISSIONED: 2013-08-30
U$33 (ARROW_1): BOM: NO; COMMISSIONED: 2013-08-30
U$34 (ARROW_1): BOM: NO; COMMISSIONED: 2013-08-30
U$95 (ARROW_1): BOM: NO; COMMISSIONED: 2013-08-30
U$96 (ARROW_1): BOM: NO; COMMISSIONED: 2013-08-30

### Parts
IC1201  XC2C384-10TQG144C  XC2C384-XXTQG144X  [S_TQFP144]
J1201  JUMPER_1X2-T-VERTICAL_GRID_2.54MM  [T_MALE_2X1_VERTICAL_PITCH_2MM54]
R1201  330  R_S_0805  [S_0805]
R1202  330  R_S_0805  [S_0805]
RN1201  10k  RN_4S_1206  [S_1206_4X]
X1201  MALE_2X5-T-VERTICAL_2MM54  [T_MALE_2X5_VERTICAL_PITCH_2MM54]
X1202  MALE_2X5-T-VERTICAL_2MM54  [T_MALE_2X5_VERTICAL_PITCH_2MM54]

### Nets
GND: R1201.1 R1202.1 X1201.2 X1201.4 X1201.6 X1201.8 X1202.2 X1202.4 X1202.6 X1202.8 ; also sheet 1,2,3,4,5,6,7,8,11,13,14,16,17,18,19,20,21,22,23,24,25
P3V3: J1201.1 ; also sheet 2,3,4,6,7,8,9,10,11,13,14,16,17,18,19,20,21,22,23,24,25
TEST_2_TCK: IC1201.67(J:TCK) R1201.2 X1201.1 X1202.1
TEST_2_TDI: IC1201.63(J:TDI) RN1201.2 X1201.7 X1202.7
TEST_2_TDO: IC1201.122(J:TDO) RN1201.3 X1201.5 X1202.5
TEST_2_TMS: IC1201.65(J:TMS) R1202.2 X1201.3 X1202.3
TEST_2_VREF: J1201.2 RN1201.6 RN1201.7 X1201.10 X1202.10
Unconnected: RN1201.1 RN1201.4 RN1201.5 RN1201.8 X1201.9 X1202.9

### Notes on the sheet
- NOTE: close for 
  in-system-programming

## Sheet 13 of 25
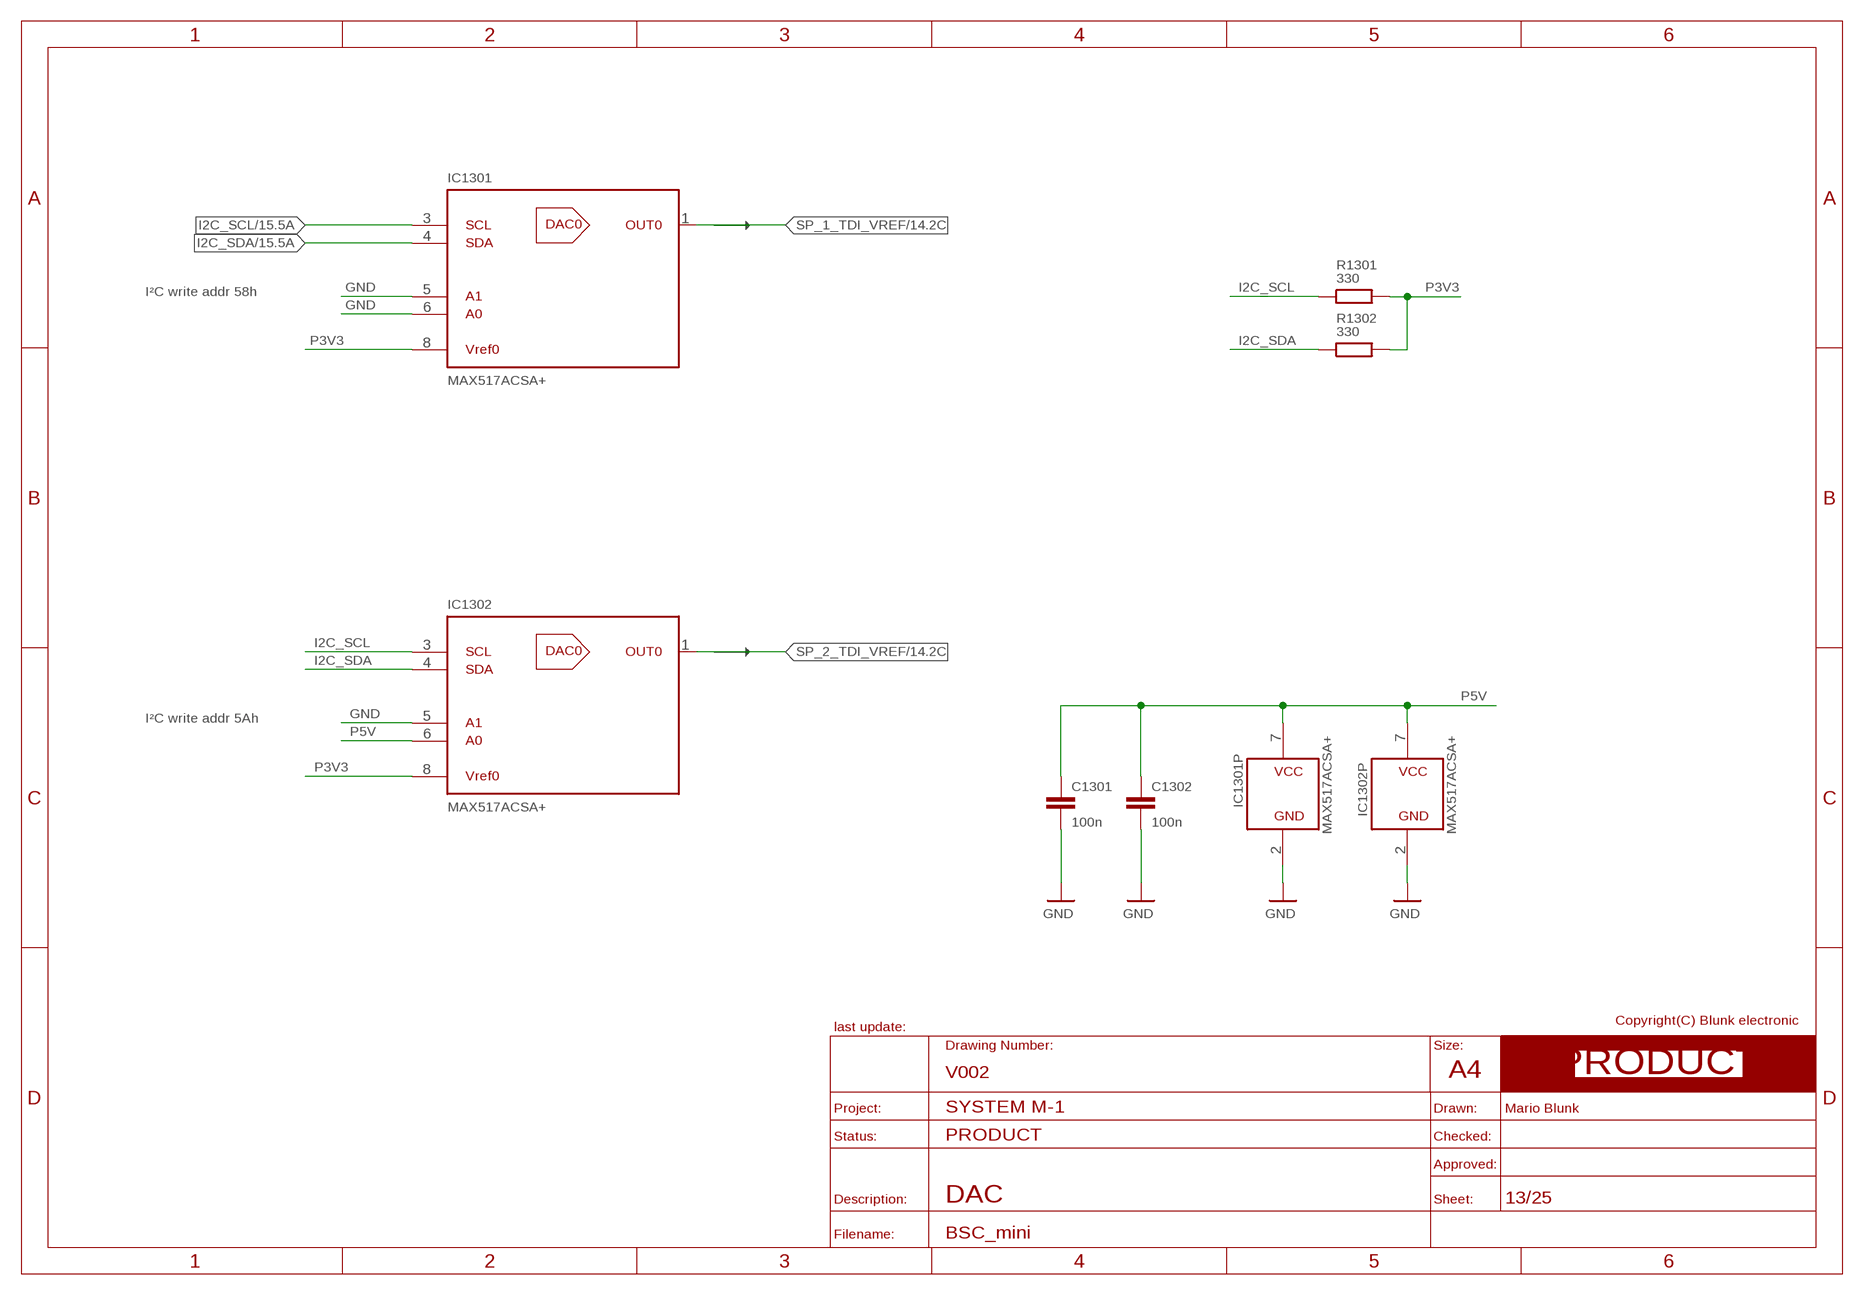
[diagram p12: schematic, sheet 13]
FRAME_PRODUCT19 (A4_LANDSCAPE_PRODUCT): BOM: NO; COMMISSIONED: 2013-08-30; DESCRIPTION: DAC
U$97 (ARROW_1): BOM: NO; COMMISSIONED: 2013-08-30
U$98 (ARROW_1): BOM: NO; COMMISSIONED: 2013-08-30

### Parts
C1301  100n  C_S_0805  [S_0805]
C1302  100n  C_S_0805  [S_0805]
IC1301  MAX517ACSA+  MAX517XXSA  [S_SO8]
IC1302  MAX517ACSA+  MAX517XXSA  [S_SO8]
R1301  330  R_S_0805  [S_0805]
R1302  330  R_S_0805  [S_0805]

### Nets
GND: C1301.2 C1302.2 IC1301.2(GND) IC1301.5(A1) IC1301.6(A0) IC1302.2(GND) IC1302.5(A1) ; also sheet 1,2,3,4,5,6,7,8,11,12,14,16,17,18,19,20,21,22,23,24,25
I2C_SCL: IC1301.3(SCL) IC1302.3(SCL) R1301.1 ; also sheet 7,10,15,17,19
I2C_SDA: IC1301.4(SDA) IC1302.4(SDA) R1302.1 ; also sheet 7,10,15,17,19
P3V3: IC1301.8(VREF0) IC1302.8(VREF0) R1301.2 R1302.2 ; also sheet 2,3,4,6,7,8,9,10,11,12,14,16,17,18,19,20,21,22,23,24,25
P5V: C1301.1 C1302.1 IC1301.7(VCC) IC1302.6(A0) IC1302.7(VCC) ; also sheet 2
SP_1_TDI_VREF: IC1301.1(OUT0) ; also sheet 14,17
SP_2_TDI_VREF: IC1302.1(OUT0) ; also sheet 14,17

### Notes on the sheet
- I²C write addr 58h
- I²C write addr 5Ah

## Sheet 14 of 25
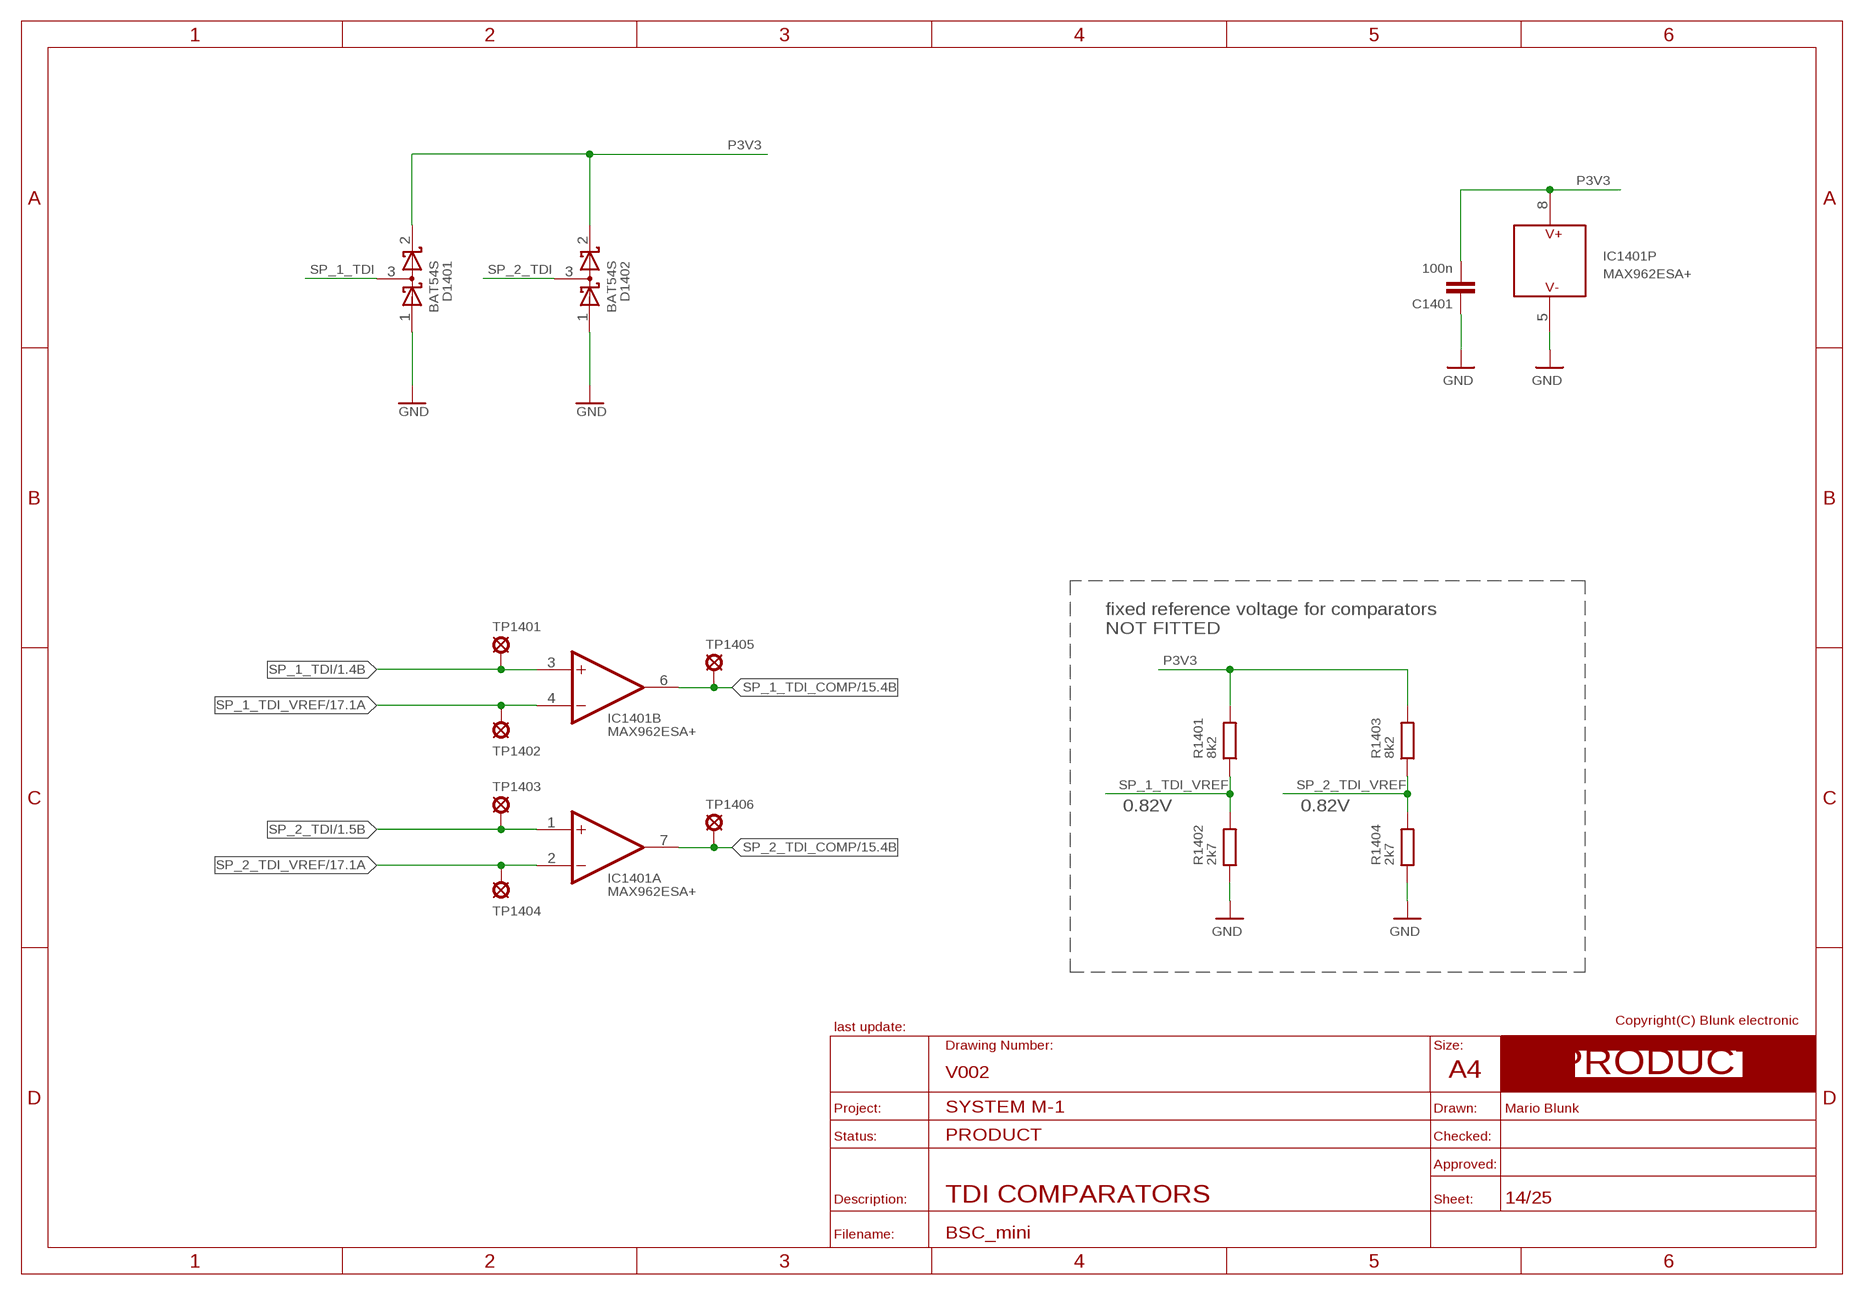
[diagram p13: schematic, sheet 14]
FRAME_PRODUCT18 (A4_LANDSCAPE_PRODUCT): BOM: NO; COMMISSIONED: 2013-08-30; DESCRIPTION: TDI COMPARATORS

### Parts
C1401  100n  C_S_0805  [S_0805]
D1401  BAT54S  DUAL_COMMON_AC_SCHOTTKY  [S_SOT23]
D1402  BAT54S  DUAL_COMMON_AC_SCHOTTKY  [S_SOT23]
IC1401  MAX962ESA+  MAX962ESA  [S_SO8]
R1401  8k2  R_S_0805  [S_0805]
R1402  2k7  R_S_0805  [S_0805]
R1403  8k2  R_S_0805  [S_0805]
R1404  2k7  R_S_0805  [S_0805]
TP1401  TEST_POINT_T_SMALL  [T_TEST_POINT_SMALL]
TP1402  TEST_POINT_T_SMALL  [T_TEST_POINT_SMALL]
TP1403  TEST_POINT_T_SMALL  [T_TEST_POINT_SMALL]
TP1404  TEST_POINT_T_SMALL  [T_TEST_POINT_SMALL]
TP1405  TEST_POINT_T_SMALL  [T_TEST_POINT_SMALL]
TP1406  TEST_POINT_T_SMALL  [T_TEST_POINT_SMALL]

### Nets
GND: C1401.1 D1401.1(A2) D1402.1(A2) IC1401.5(P:V-) R1402.1 R1404.1 ; also sheet 1,2,3,4,5,6,7,8,11,12,13,16,17,18,19,20,21,22,23,24,25
P3V3: C1401.2 D1401.2(K1) D1402.2(K1) IC1401.8(P:V+) R1401.2 R1403.2 ; also sheet 2,3,4,6,7,8,9,10,11,12,13,16,17,18,19,20,21,22,23,24,25
SP_1_TDI: D1401.3(A1K2) IC1401.3(B:+IN) TP1401.1(TP) ; also sheet 1
SP_1_TDI_COMP: IC1401.6(B:OUT) TP1405.1(TP) ; also sheet 15,21
SP_1_TDI_VREF: IC1401.4(B:-IN) R1401.1 R1402.2 TP1402.1(TP) ; also sheet 13,17
SP_2_TDI: D1402.3(A1K2) IC1401.1(A:+IN) TP1403.1(TP) ; also sheet 1
SP_2_TDI_COMP: IC1401.7(A:OUT) TP1406.1(TP) ; also sheet 15,21
SP_2_TDI_VREF: IC1401.2(A:-IN) R1403.1 R1404.2 TP1404.1(TP) ; also sheet 13,17

### Notes on the sheet
- fixed reference voltage for comparators
  NOT FITTED
- 0.82V | 0.82V

## Sheet 15 of 25
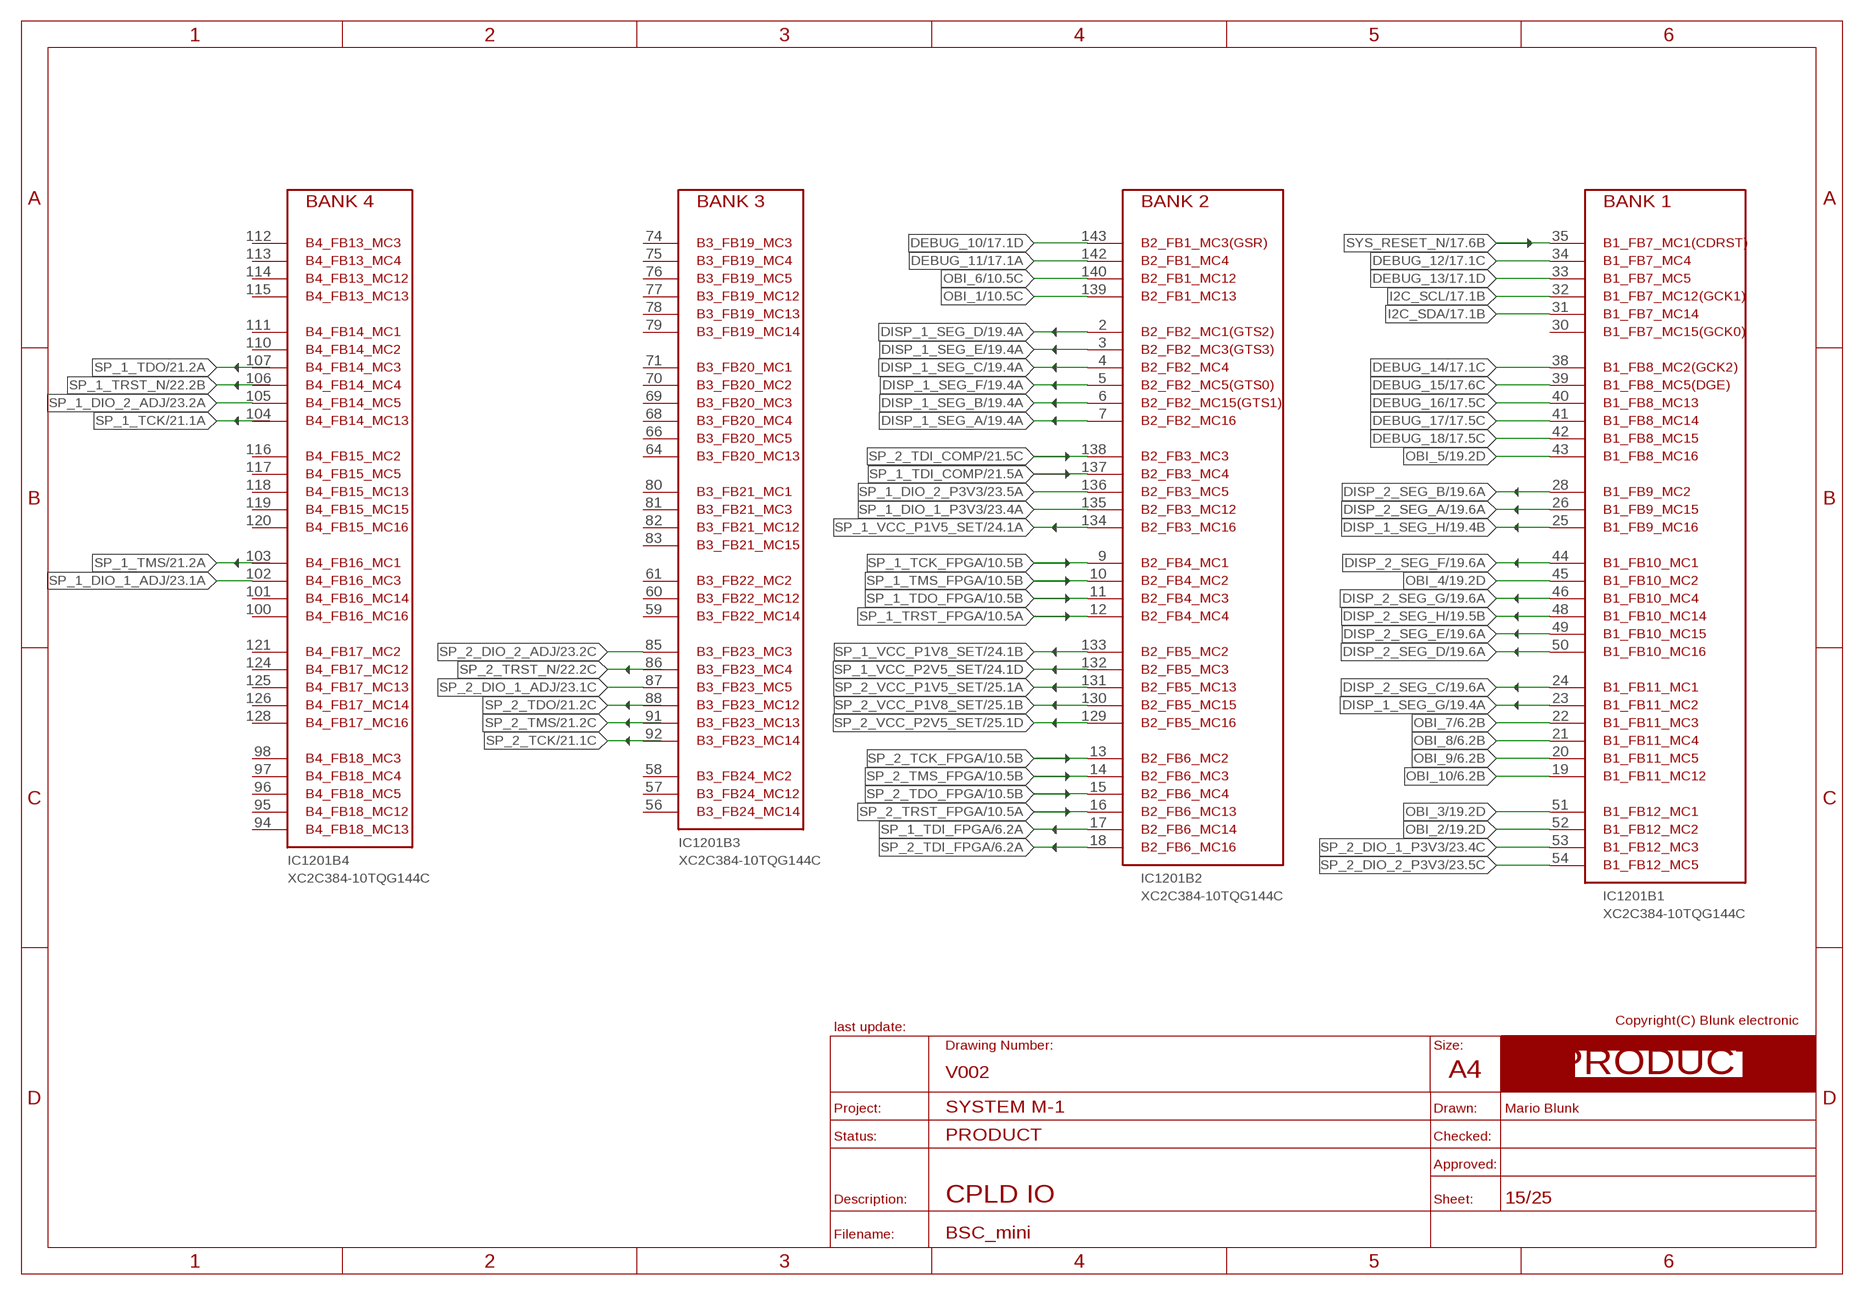
[diagram p14: schematic, sheet 15]
FRAME_PRODUCT20 (A4_LANDSCAPE_PRODUCT): BOM: NO; COMMISSIONED: 2013-08-30; DESCRIPTION: CPLD IO
U$99 (ARROW_1): BOM: NO; COMMISSIONED: 2013-08-30
U$100 (ARROW_1): BOM: NO; COMMISSIONED: 2013-08-30
U$101 (ARROW_1): BOM: NO; COMMISSIONED: 2013-08-30
U$102 (ARROW_1): BOM: NO; COMMISSIONED: 2013-08-30
U$103 (ARROW_1): BOM: NO; COMMISSIONED: 2013-08-30
U$104 (ARROW_1): BOM: NO; COMMISSIONED: 2013-08-30
U$105 (ARROW_1): BOM: NO; COMMISSIONED: 2013-08-30
U$106 (ARROW_1): BOM: NO; COMMISSIONED: 2013-08-30
U$107 (ARROW_1): BOM: NO; COMMISSIONED: 2013-08-30
U$108 (ARROW_1): BOM: NO; COMMISSIONED: 2013-08-30
U$109 (ARROW_1): BOM: NO; COMMISSIONED: 2013-08-30
U$110 (ARROW_1): BOM: NO; COMMISSIONED: 2013-08-30
U$111 (ARROW_1): BOM: NO; COMMISSIONED: 2013-08-30
U$112 (ARROW_1): BOM: NO; COMMISSIONED: 2013-08-30
U$113 (ARROW_1): BOM: NO; COMMISSIONED: 2013-08-30
U$114 (ARROW_1): BOM: NO; COMMISSIONED: 2013-08-30
U$115 (ARROW_1): BOM: NO; COMMISSIONED: 2013-08-30
U$116 (ARROW_1): BOM: NO; COMMISSIONED: 2013-08-30
U$117 (ARROW_1): BOM: NO; COMMISSIONED: 2013-08-30
U$118 (ARROW_1): BOM: NO; COMMISSIONED: 2013-08-30
U$119 (ARROW_1): BOM: NO; COMMISSIONED: 2013-08-30
U$120 (ARROW_1): BOM: NO; COMMISSIONED: 2013-08-30
U$121 (ARROW_1): BOM: NO; COMMISSIONED: 2013-08-30
U$122 (ARROW_1): BOM: NO; COMMISSIONED: 2013-08-30
U$123 (ARROW_1): BOM: NO; COMMISSIONED: 2013-08-30
U$124 (ARROW_1): BOM: NO; COMMISSIONED: 2013-08-30
U$125 (ARROW_1): BOM: NO; COMMISSIONED: 2013-08-30
U$126 (ARROW_1): BOM: NO; COMMISSIONED: 2013-08-30
U$127 (ARROW_1): BOM: NO; COMMISSIONED: 2013-08-30
U$128 (ARROW_1): BOM: NO; COMMISSIONED: 2013-08-30
U$129 (ARROW_1): BOM: NO; COMMISSIONED: 2013-08-30
U$130 (ARROW_1): BOM: NO; COMMISSIONED: 2013-08-30
U$131 (ARROW_1): BOM: NO; COMMISSIONED: 2013-08-30
U$132 (ARROW_1): BOM: NO; COMMISSIONED: 2013-08-30
U$133 (ARROW_1): BOM: NO; COMMISSIONED: 2013-08-30
U$134 (ARROW_1): BOM: NO; COMMISSIONED: 2013-08-30
U$135 (ARROW_1): BOM: NO; COMMISSIONED: 2013-08-30
U$136 (ARROW_1): BOM: NO; COMMISSIONED: 2013-08-30
U$137 (ARROW_1): BOM: NO; COMMISSIONED: 2013-08-30
U$138 (ARROW_1): BOM: NO; COMMISSIONED: 2013-08-30
U$139 (ARROW_1): BOM: NO; COMMISSIONED: 2013-08-30
U$140 (ARROW_1): BOM: NO; COMMISSIONED: 2013-08-30
U$141 (ARROW_1): BOM: NO; COMMISSIONED: 2013-08-30

### Nets
DEBUG_10: IC1201.143(B2:B2_FB1_MC3(GSR)) ; also sheet 17
DEBUG_11: IC1201.142(B2:B2_FB1_MC4) ; also sheet 17
DEBUG_12: IC1201.34(B1:B1_FB7_MC4) ; also sheet 17
DEBUG_13: IC1201.33(B1:B1_FB7_MC5) ; also sheet 17
DEBUG_14: IC1201.38(B1:B1_FB8_MC2(GCK2)) ; also sheet 17,20
DEBUG_15: IC1201.39(B1:B1_FB8_MC5(DGE)) ; also sheet 17,20
DEBUG_16: IC1201.40(B1:B1_FB8_MC13) ; also sheet 17,20
DEBUG_17: IC1201.41(B1:B1_FB8_MC14) ; also sheet 17,20
DEBUG_18: IC1201.42(B1:B1_FB8_MC15) ; also sheet 17,20
DISP_1_SEG_A: IC1201.7(B2:B2_FB2_MC16) ; also sheet 19
DISP_1_SEG_B: IC1201.6(B2:B2_FB2_MC15(GTS1)) ; also sheet 19
DISP_1_SEG_C: IC1201.4(B2:B2_FB2_MC4) ; also sheet 19
DISP_1_SEG_D: IC1201.2(B2:B2_FB2_MC1(GTS2)) ; also sheet 19
DISP_1_SEG_E: IC1201.3(B2:B2_FB2_MC3(GTS3)) ; also sheet 19
DISP_1_SEG_F: IC1201.5(B2:B2_FB2_MC5(GTS0)) ; also sheet 19
DISP_1_SEG_G: IC1201.23(B1:B1_FB11_MC2) ; also sheet 19
DISP_1_SEG_H: IC1201.25(B1:B1_FB9_MC16) ; also sheet 19
DISP_2_SEG_A: IC1201.26(B1:B1_FB9_MC15) ; also sheet 19
DISP_2_SEG_B: IC1201.28(B1:B1_FB9_MC2) ; also sheet 19
DISP_2_SEG_C: IC1201.24(B1:B1_FB11_MC1) ; also sheet 19
DISP_2_SEG_D: IC1201.50(B1:B1_FB10_MC16) ; also sheet 19
DISP_2_SEG_E: IC1201.49(B1:B1_FB10_MC15) ; also sheet 19
DISP_2_SEG_F: IC1201.44(B1:B1_FB10_MC1) ; also sheet 19
DISP_2_SEG_G: IC1201.46(B1:B1_FB10_MC4) ; also sheet 19
DISP_2_SEG_H: IC1201.48(B1:B1_FB10_MC14) ; also sheet 19
I2C_SCL: IC1201.32(B1:B1_FB7_MC12(GCK1)) ; also sheet 7,10,13,17,19
I2C_SDA: IC1201.31(B1:B1_FB7_MC14) ; also sheet 7,10,13,17,19
OBI_1: IC1201.139(B2:B2_FB1_MC13) ; also sheet 10
OBI_2: IC1201.52(B1:B1_FB12_MC2) ; also sheet 10,19
OBI_3: IC1201.51(B1:B1_FB12_MC1) ; also sheet 10,19
OBI_4: IC1201.45(B1:B1_FB10_MC2) ; also sheet 10,19
OBI_5: IC1201.43(B1:B1_FB8_MC16) ; also sheet 10,19
OBI_6: IC1201.140(B2:B2_FB1_MC12) ; also sheet 10
OBI_7: IC1201.22(B1:B1_FB11_MC3) ; also sheet 6,10
OBI_8: IC1201.21(B1:B1_FB11_MC4) ; also sheet 6,10
OBI_9: IC1201.20(B1:B1_FB11_MC5) ; also sheet 6,10
OBI_10: IC1201.19(B1:B1_FB11_MC12) ; also sheet 6,10
SP_1_DIO_1_ADJ: IC1201.102(B4:B4_FB16_MC3) ; also sheet 1,23
SP_1_DIO_1_P3V3: IC1201.135(B2:B2_FB3_MC12) ; also sheet 1,23
SP_1_DIO_2_ADJ: IC1201.105(B4:B4_FB14_MC5) ; also sheet 1,23
SP_1_DIO_2_P3V3: IC1201.136(B2:B2_FB3_MC5) ; also sheet 1,23
SP_1_TCK: IC1201.104(B4:B4_FB14_MC13) ; also sheet 1,21
SP_1_TCK_FPGA: IC1201.9(B2:B2_FB4_MC1) ; also sheet 10
SP_1_TDI_COMP: IC1201.137(B2:B2_FB3_MC4) ; also sheet 14,21
SP_1_TDI_FPGA: IC1201.17(B2:B2_FB6_MC14) ; also sheet 6,10
SP_1_TDO: IC1201.107(B4:B4_FB14_MC3) ; also sheet 1,21
SP_1_TDO_FPGA: IC1201.11(B2:B2_FB4_MC3) ; also sheet 10
SP_1_TMS: IC1201.103(B4:B4_FB16_MC1) ; also sheet 1,21
SP_1_TMS_FPGA: IC1201.10(B2:B2_FB4_MC2) ; also sheet 10
SP_1_TRST_FPGA: IC1201.12(B2:B2_FB4_MC4) ; also sheet 10
SP_1_TRST_N: IC1201.106(B4:B4_FB14_MC4) ; also sheet 1,22
SP_1_VCC_P1V5_SET: IC1201.134(B2:B2_FB3_MC16) ; also sheet 3,24
SP_1_VCC_P1V8_SET: IC1201.133(B2:B2_FB5_MC2) ; also sheet 3,24
SP_1_VCC_P2V5_SET: IC1201.132(B2:B2_FB5_MC3) ; also sheet 3,24
SP_2_DIO_1_ADJ: IC1201.87(B3:B3_FB23_MC5) ; also sheet 1,23
SP_2_DIO_1_P3V3: IC1201.53(B1:B1_FB12_MC3) ; also sheet 1,23
SP_2_DIO_2_ADJ: IC1201.85(B3:B3_FB23_MC3) ; also sheet 1,23
SP_2_DIO_2_P3V3: IC1201.54(B1:B1_FB12_MC5) ; also sheet 1,23
SP_2_TCK: IC1201.92(B3:B3_FB23_MC14) ; also sheet 1,21
SP_2_TCK_FPGA: IC1201.13(B2:B2_FB6_MC2) ; also sheet 10
SP_2_TDI_COMP: IC1201.138(B2:B2_FB3_MC3) ; also sheet 14,21
SP_2_TDI_FPGA: IC1201.18(B2:B2_FB6_MC16) ; also sheet 6,10
SP_2_TDO: IC1201.88(B3:B3_FB23_MC12) ; also sheet 1,21
SP_2_TDO_FPGA: IC1201.15(B2:B2_FB6_MC4) ; also sheet 10
SP_2_TMS: IC1201.91(B3:B3_FB23_MC13) ; also sheet 1,21
SP_2_TMS_FPGA: IC1201.14(B2:B2_FB6_MC3) ; also sheet 10
SP_2_TRST_FPGA: IC1201.16(B2:B2_FB6_MC13) ; also sheet 10
SP_2_TRST_N: IC1201.86(B3:B3_FB23_MC4) ; also sheet 1,22
SP_2_VCC_P1V5_SET: IC1201.131(B2:B2_FB5_MC13) ; also sheet 3,25
SP_2_VCC_P1V8_SET: IC1201.130(B2:B2_FB5_MC15) ; also sheet 3,25
SP_2_VCC_P2V5_SET: IC1201.129(B2:B2_FB5_MC16) ; also sheet 3,25
SYS_RESET_N: IC1201.35(B1:B1_FB7_MC1(CDRST)) ; also sheet 4,9,17
Unconnected: IC1201.30(B1:B1_FB7_MC15(GCK0)) IC1201.56(B3:B3_FB24_MC14) IC1201.57(B3:B3_FB24_MC12) IC1201.58(B3:B3_FB24_MC2) IC1201.59(B3:B3_FB22_MC14) IC1201.60(B3:B3_FB22_MC12) IC1201.61(B3:B3_FB22_MC2) IC1201.64(B3:B3_FB20_MC13) IC1201.66(B3:B3_FB20_MC5) IC1201.68(B3:B3_FB20_MC4) IC1201.69(B3:B3_FB20_MC3) IC1201.70(B3:B3_FB20_MC2) IC1201.71(B3:B3_FB20_MC1) IC1201.74(B3:B3_FB19_MC3) IC1201.75(B3:B3_FB19_MC4) IC1201.76(B3:B3_FB19_MC5) IC1201.77(B3:B3_FB19_MC12) IC1201.78(B3:B3_FB19_MC13) IC1201.79(B3:B3_FB19_MC14) IC1201.80(B3:B3_FB21_MC1) IC1201.81(B3:B3_FB21_MC3) IC1201.82(B3:B3_FB21_MC12) IC1201.83(B3:B3_FB21_MC15) IC1201.94(B4:B4_FB18_MC13) IC1201.95(B4:B4_FB18_MC12) IC1201.96(B4:B4_FB18_MC5) IC1201.97(B4:B4_FB18_MC4) IC1201.98(B4:B4_FB18_MC3) IC1201.100(B4:B4_FB16_MC16) IC1201.101(B4:B4_FB16_MC14) IC1201.110(B4:B4_FB14_MC2) IC1201.111(B4:B4_FB14_MC1) IC1201.112(B4:B4_FB13_MC3) IC1201.113(B4:B4_FB13_MC4) IC1201.114(B4:B4_FB13_MC12) IC1201.115(B4:B4_FB13_MC13) IC1201.116(B4:B4_FB15_MC2) IC1201.117(B4:B4_FB15_MC5) IC1201.118(B4:B4_FB15_MC13) IC1201.119(B4:B4_FB15_MC15) IC1201.120(B4:B4_FB15_MC16) IC1201.121(B4:B4_FB17_MC2) IC1201.124(B4:B4_FB17_MC12) IC1201.125(B4:B4_FB17_MC13) IC1201.126(B4:B4_FB17_MC14) IC1201.128(B4:B4_FB17_MC16)

## Sheet 16 of 25
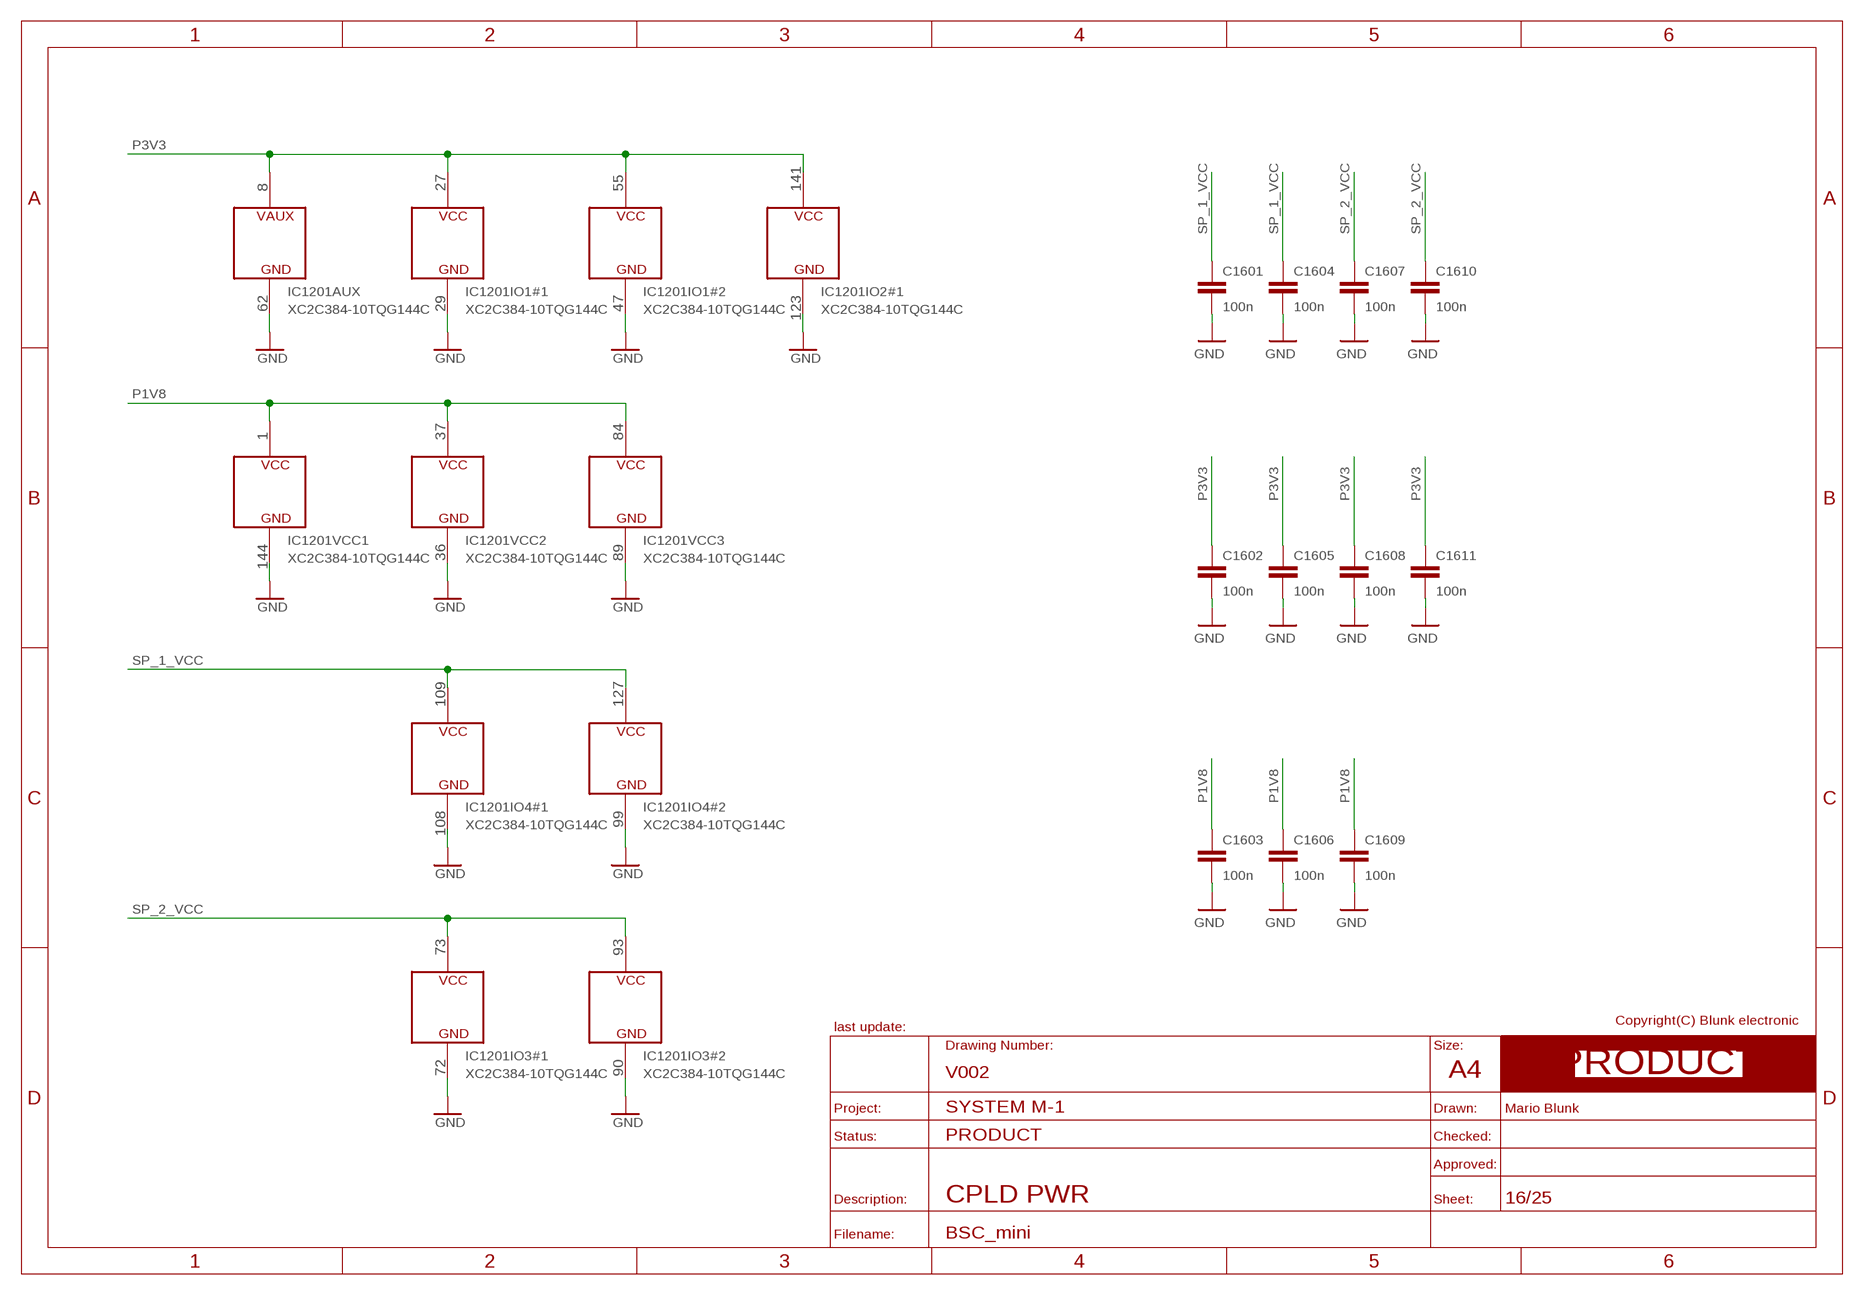
[diagram p15: schematic, sheet 16]
FRAME_PRODUCT21 (A4_LANDSCAPE_PRODUCT): BOM: NO; COMMISSIONED: 2013-08-30; DESCRIPTION: CPLD PWR

### Parts
C1601  100n  C_S_0805  [S_0805]
C1602  100n  C_S_0805  [S_0805]
C1603  100n  C_S_0805  [S_0805]
C1604  100n  C_S_0805  [S_0805]
C1605  100n  C_S_0805  [S_0805]
C1606  100n  C_S_0805  [S_0805]
C1607  100n  C_S_0805  [S_0805]
C1608  100n  C_S_0805  [S_0805]
C1609  100n  C_S_0805  [S_0805]
C1610  100n  C_S_0805  [S_0805]
C1611  100n  C_S_0805  [S_0805]

### Nets
GND: C1601.2 C1602.2 C1603.2 C1604.2 C1605.2 C1606.2 C1607.2 C1608.2 C1609.2 C1610.2 C1611.2 IC1201.29(IO1#1:GND) IC1201.36(VCC2:GND) IC1201.47(IO1#2:GND) IC1201.62(AUX:GND) IC1201.72(IO3#1:GND) IC1201.89(VCC3:GND) IC1201.90(IO3#2:GND) IC1201.99(IO4#2:GND) IC1201.108(IO4#1:GND) IC1201.123(IO2#1:GND) IC1201.144(VCC1:GND) ; also sheet 1,2,3,4,5,6,7,8,11,12,13,14,17,18,19,20,21,22,23,24,25
P1V8: C1603.1 C1606.1 C1609.1 IC1201.1(VCC1:VCC) IC1201.37(VCC2:VCC) IC1201.84(VCC3:VCC) ; also sheet 2
P3V3: C1602.1 C1605.1 C1608.1 C1611.1 IC1201.8(AUX:VAUX) IC1201.27(IO1#1:VCC_IO) IC1201.55(IO1#2:VCC_IO) IC1201.141(IO2#1:VCC_IO) ; also sheet 2,3,4,6,7,8,9,10,11,12,13,14,17,18,19,20,21,22,23,24,25
SP_1_VCC: C1601.1 C1604.1 IC1201.109(IO4#1:VCC_IO) IC1201.127(IO4#2:VCC_IO) ; also sheet 3
SP_2_VCC: C1607.1 C1610.1 IC1201.73(IO3#1:VCC_IO) IC1201.93(IO3#2:VCC_IO) ; also sheet 3

## Sheet 17 of 25
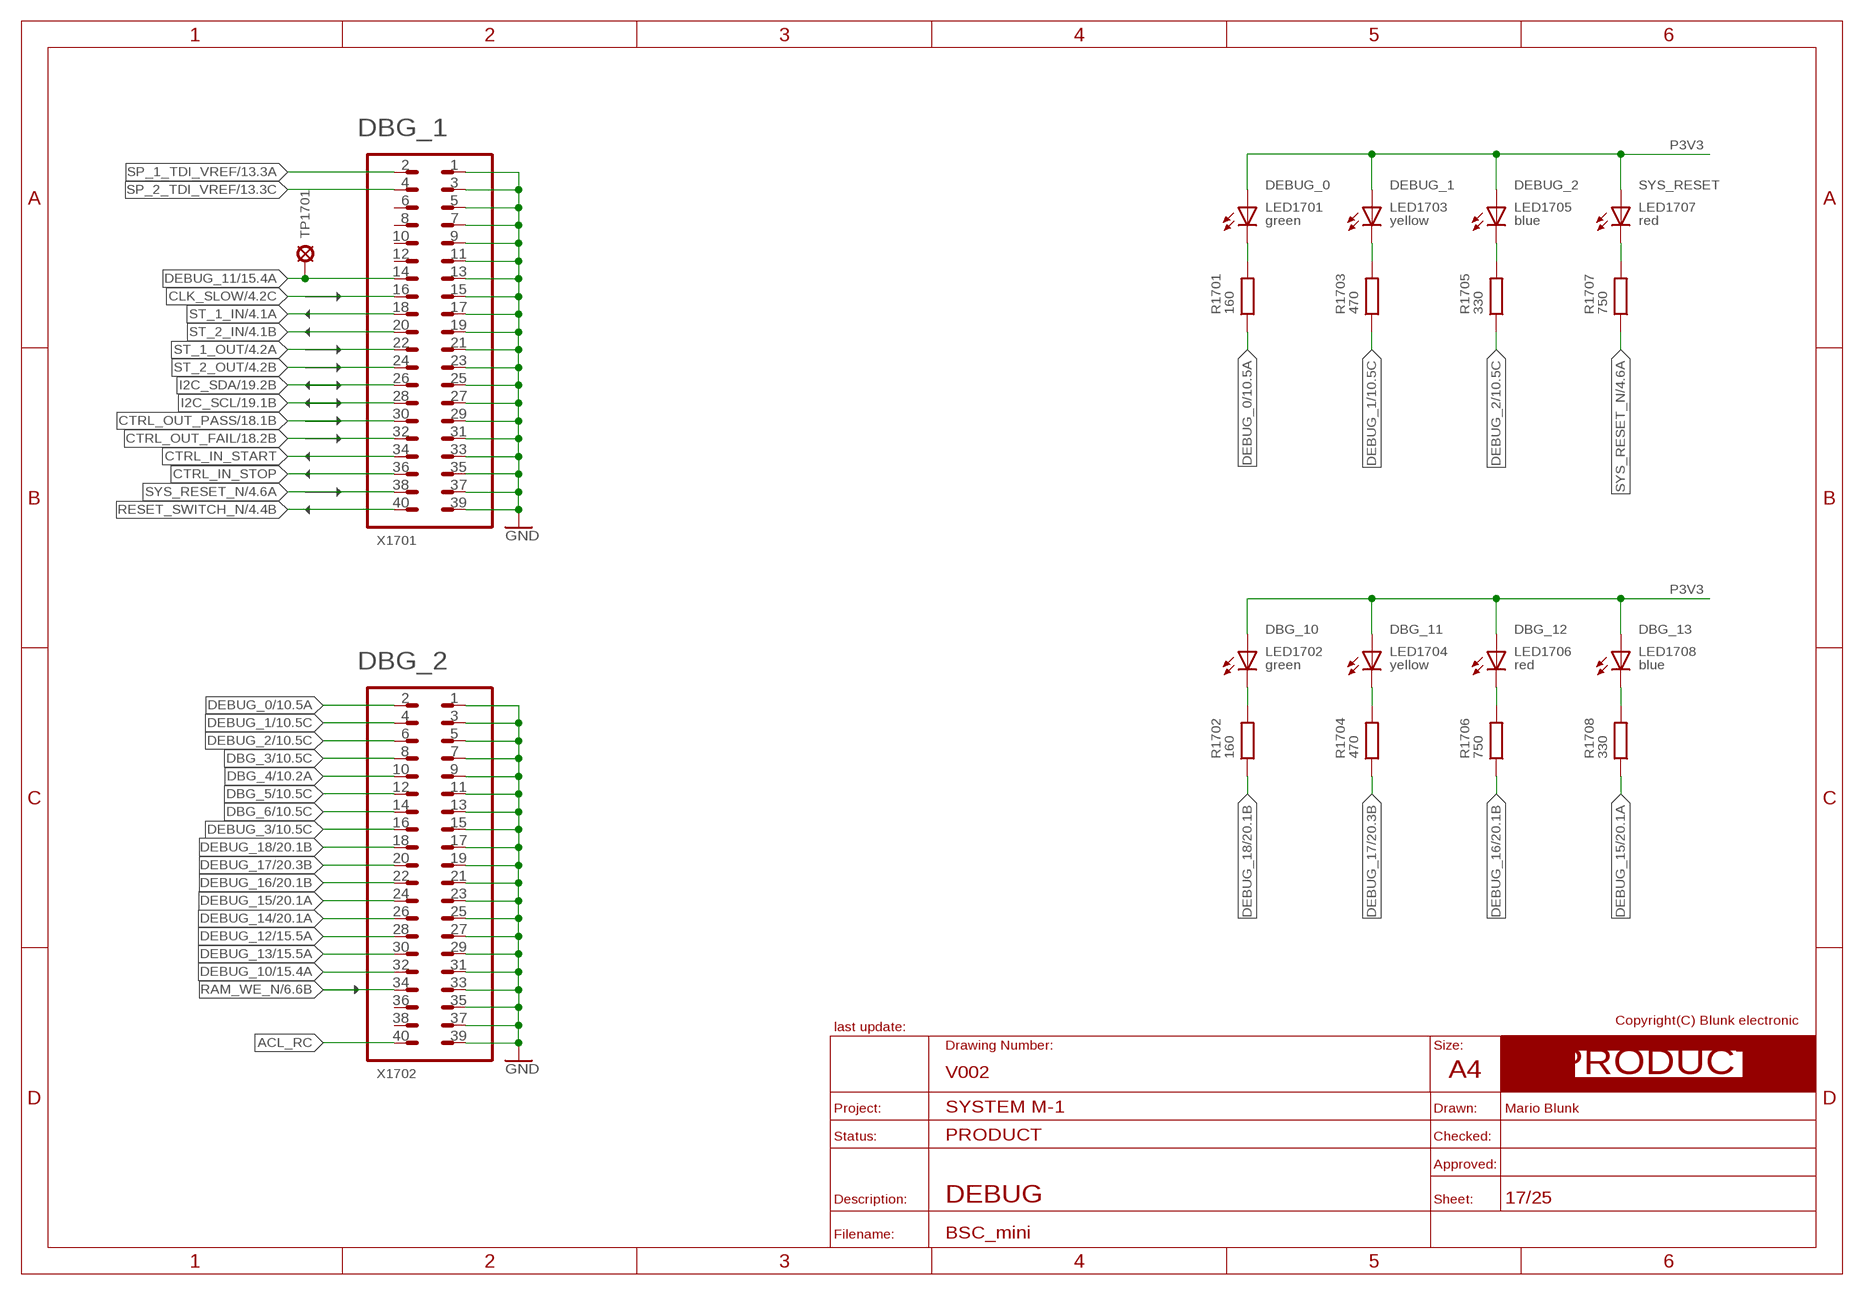
[diagram p16: schematic, sheet 17]
FRAME_PRODUCT7 (A4_LANDSCAPE_PRODUCT): BOM: NO; COMMISSIONED: 2013-08-30; DESCRIPTION: DEBUG
U$1 (ARROW_1): BOM: NO; COMMISSIONED: 2013-08-30
U$2 (ARROW_1): BOM: NO; COMMISSIONED: 2013-08-30
U$3 (ARROW_1): BOM: NO; COMMISSIONED: 2013-08-30
U$4 (ARROW_1): BOM: NO; COMMISSIONED: 2013-08-30
U$5 (ARROW_1): BOM: NO; COMMISSIONED: 2013-08-30
U$6 (ARROW_1): BOM: NO; COMMISSIONED: 2013-08-30
U$7 (ARROW_1): BOM: NO; COMMISSIONED: 2013-08-30
U$8 (ARROW_1): BOM: NO; COMMISSIONED: 2013-08-30
U$9 (ARROW_1): BOM: NO; COMMISSIONED: 2013-08-30
U$10 (ARROW_1): BOM: NO; COMMISSIONED: 2013-08-30
U$11 (ARROW_1): BOM: NO; COMMISSIONED: 2013-08-30
U$12 (ARROW_1): BOM: NO; COMMISSIONED: 2013-08-30
U$13 (ARROW_1): BOM: NO; COMMISSIONED: 2013-08-30
U$14 (ARROW_1): BOM: NO; COMMISSIONED: 2013-08-30
U$15 (ARROW_1): BOM: NO; COMMISSIONED: 2013-08-30
U$142 (ARROW_1): BOM: NO; COMMISSIONED: 2013-08-30

### Parts
LED1701  green  LED_S_0805  [S_0805]
LED1702  green  LED_S_0805  [S_0805]
LED1703  yellow  LED_S_0805  [S_0805]
LED1704  yellow  LED_S_0805  [S_0805]
LED1705  blue  LED_S_0805  [S_0805]
LED1706  red  LED_S_0805  [S_0805]
LED1707  red  LED_S_0805  [S_0805]
LED1708  blue  LED_S_0805  [S_0805]
R1701  160  R_S_0805  [S_0805]
R1702  160  R_S_0805  [S_0805]
R1703  470  R_S_0805  [S_0805]
R1704  470  R_S_0805  [S_0805]
R1705  330  R_S_0805  [S_0805]
R1706  750  R_S_0805  [S_0805]
R1707  750  R_S_0805  [S_0805]
R1708  330  R_S_0805  [S_0805]
TP1701  TEST_POINT_T_SMALL  [T_TEST_POINT_SMALL]
X1701  MALE_2X20-T-VERTICAL  [T_MALE_2X20_VERTICAL_GRID_2.54MM]
X1702  MALE_2X20-T-VERTICAL  [T_MALE_2X20_VERTICAL_GRID_2.54MM]

### Nets
ACL_RC: X1702.40 ; also sheet 20
CLK_SLOW: X1701.16 ; also sheet 4,9
CTRL_IN_START: X1701.34 ; also sheet 18
CTRL_IN_STOP: X1701.36 ; also sheet 18
CTRL_OUT_FAIL: X1701.32 ; also sheet 10,18
CTRL_OUT_PASS: X1701.30 ; also sheet 10,18
DBG_3: X1702.8 ; also sheet 10
DBG_4: X1702.10 ; also sheet 10
DBG_5: X1702.12 ; also sheet 10
DBG_6: X1702.14 ; also sheet 10
DBG_10_LED: LED1702.C R1702.2
DBG_11_LED: LED1704.C R1704.2
DBG_12_LED: LED1706.C R1706.2
DBG_13_LED: LED1708.C R1708.2
DEBUG_0: R1701.1 X1702.2 ; also sheet 10
DEBUG_1: R1703.1 X1702.4 ; also sheet 10
DEBUG_2: R1705.1 X1702.6 ; also sheet 10
DEBUG_3: X1702.16 ; also sheet 10
DEBUG_10: X1702.32 ; also sheet 15
DEBUG_11: TP1701.1(TP) X1701.14 ; also sheet 15
DEBUG_12: X1702.28 ; also sheet 15
DEBUG_13: X1702.30 ; also sheet 15
DEBUG_14: X1702.26 ; also sheet 15,20
DEBUG_15: R1708.1 X1702.24 ; also sheet 15,20
DEBUG_16: R1706.1 X1702.22 ; also sheet 15,20
DEBUG_17: R1704.1 X1702.20 ; also sheet 15,20
DEBUG_18: R1702.1 X1702.18 ; also sheet 15,20
DGB_0_LED: LED1701.C R1701.2
DGB_1_LED: LED1703.C R1703.2
DGB_2_LED: LED1705.C R1705.2
GND: X1701.1 X1701.3 X1701.5 X1701.7 X1701.9 X1701.11 X1701.13 X1701.15 X1701.17 X1701.19 X1701.21 X1701.23 X1701.25 X1701.27 X1701.29 X1701.31 X1701.33 X1701.35 X1701.37 X1701.39 X1702.1 X1702.3 X1702.5 X1702.7 X1702.9 X1702.11 X1702.13 X1702.15 X1702.17 X1702.19 X1702.21 X1702.23 X1702.25 X1702.27 X1702.29 X1702.31 X1702.33 X1702.35 X1702.37 X1702.39 ; also sheet 1,2,3,4,5,6,7,8,11,12,13,14,16,18,19,20,21,22,23,24,25
I2C_SCL: X1701.28 ; also sheet 7,10,13,15,19
I2C_SDA: X1701.26 ; also sheet 7,10,13,15,19
P3V3: LED1701.A LED1702.A LED1703.A LED1704.A LED1705.A LED1706.A LED1707.A LED1708.A ; also sheet 2,3,4,6,7,8,9,10,11,12,13,14,16,18,19,20,21,22,23,24,25
RAM_WE_N: X1702.34 ; also sheet 6,7,9
RESET_SWITCH_N: X1701.40 ; also sheet 4
SP_1_TDI_VREF: X1701.2 ; also sheet 13,14
SP_2_TDI_VREF: X1701.4 ; also sheet 13,14
ST_1_IN: X1701.18 ; also sheet 4
ST_1_OUT: X1701.22 ; also sheet 4,9
ST_2_IN: X1701.20 ; also sheet 4
ST_2_OUT: X1701.24 ; also sheet 4,9
SYS_RESET_LED: LED1707.C R1707.2
SYS_RESET_N: R1707.1 X1701.38 ; also sheet 4,9,15
Unconnected: X1701.6 X1701.8 X1701.10 X1701.12 X1702.36 X1702.38